# EasyEDA Pro project SATAHDDProtectors.eprj

# Schematic 过滤与保护
Board Name: Board1; Create Date: 2025-07-08; Page Name: P1; Project Name: SATAHDDProtectors; Schematic Name: 过滤与保护; Update Date: 2025-07-10; Company: 嘉立创EDA; Page Size: A4; Version: V1.0
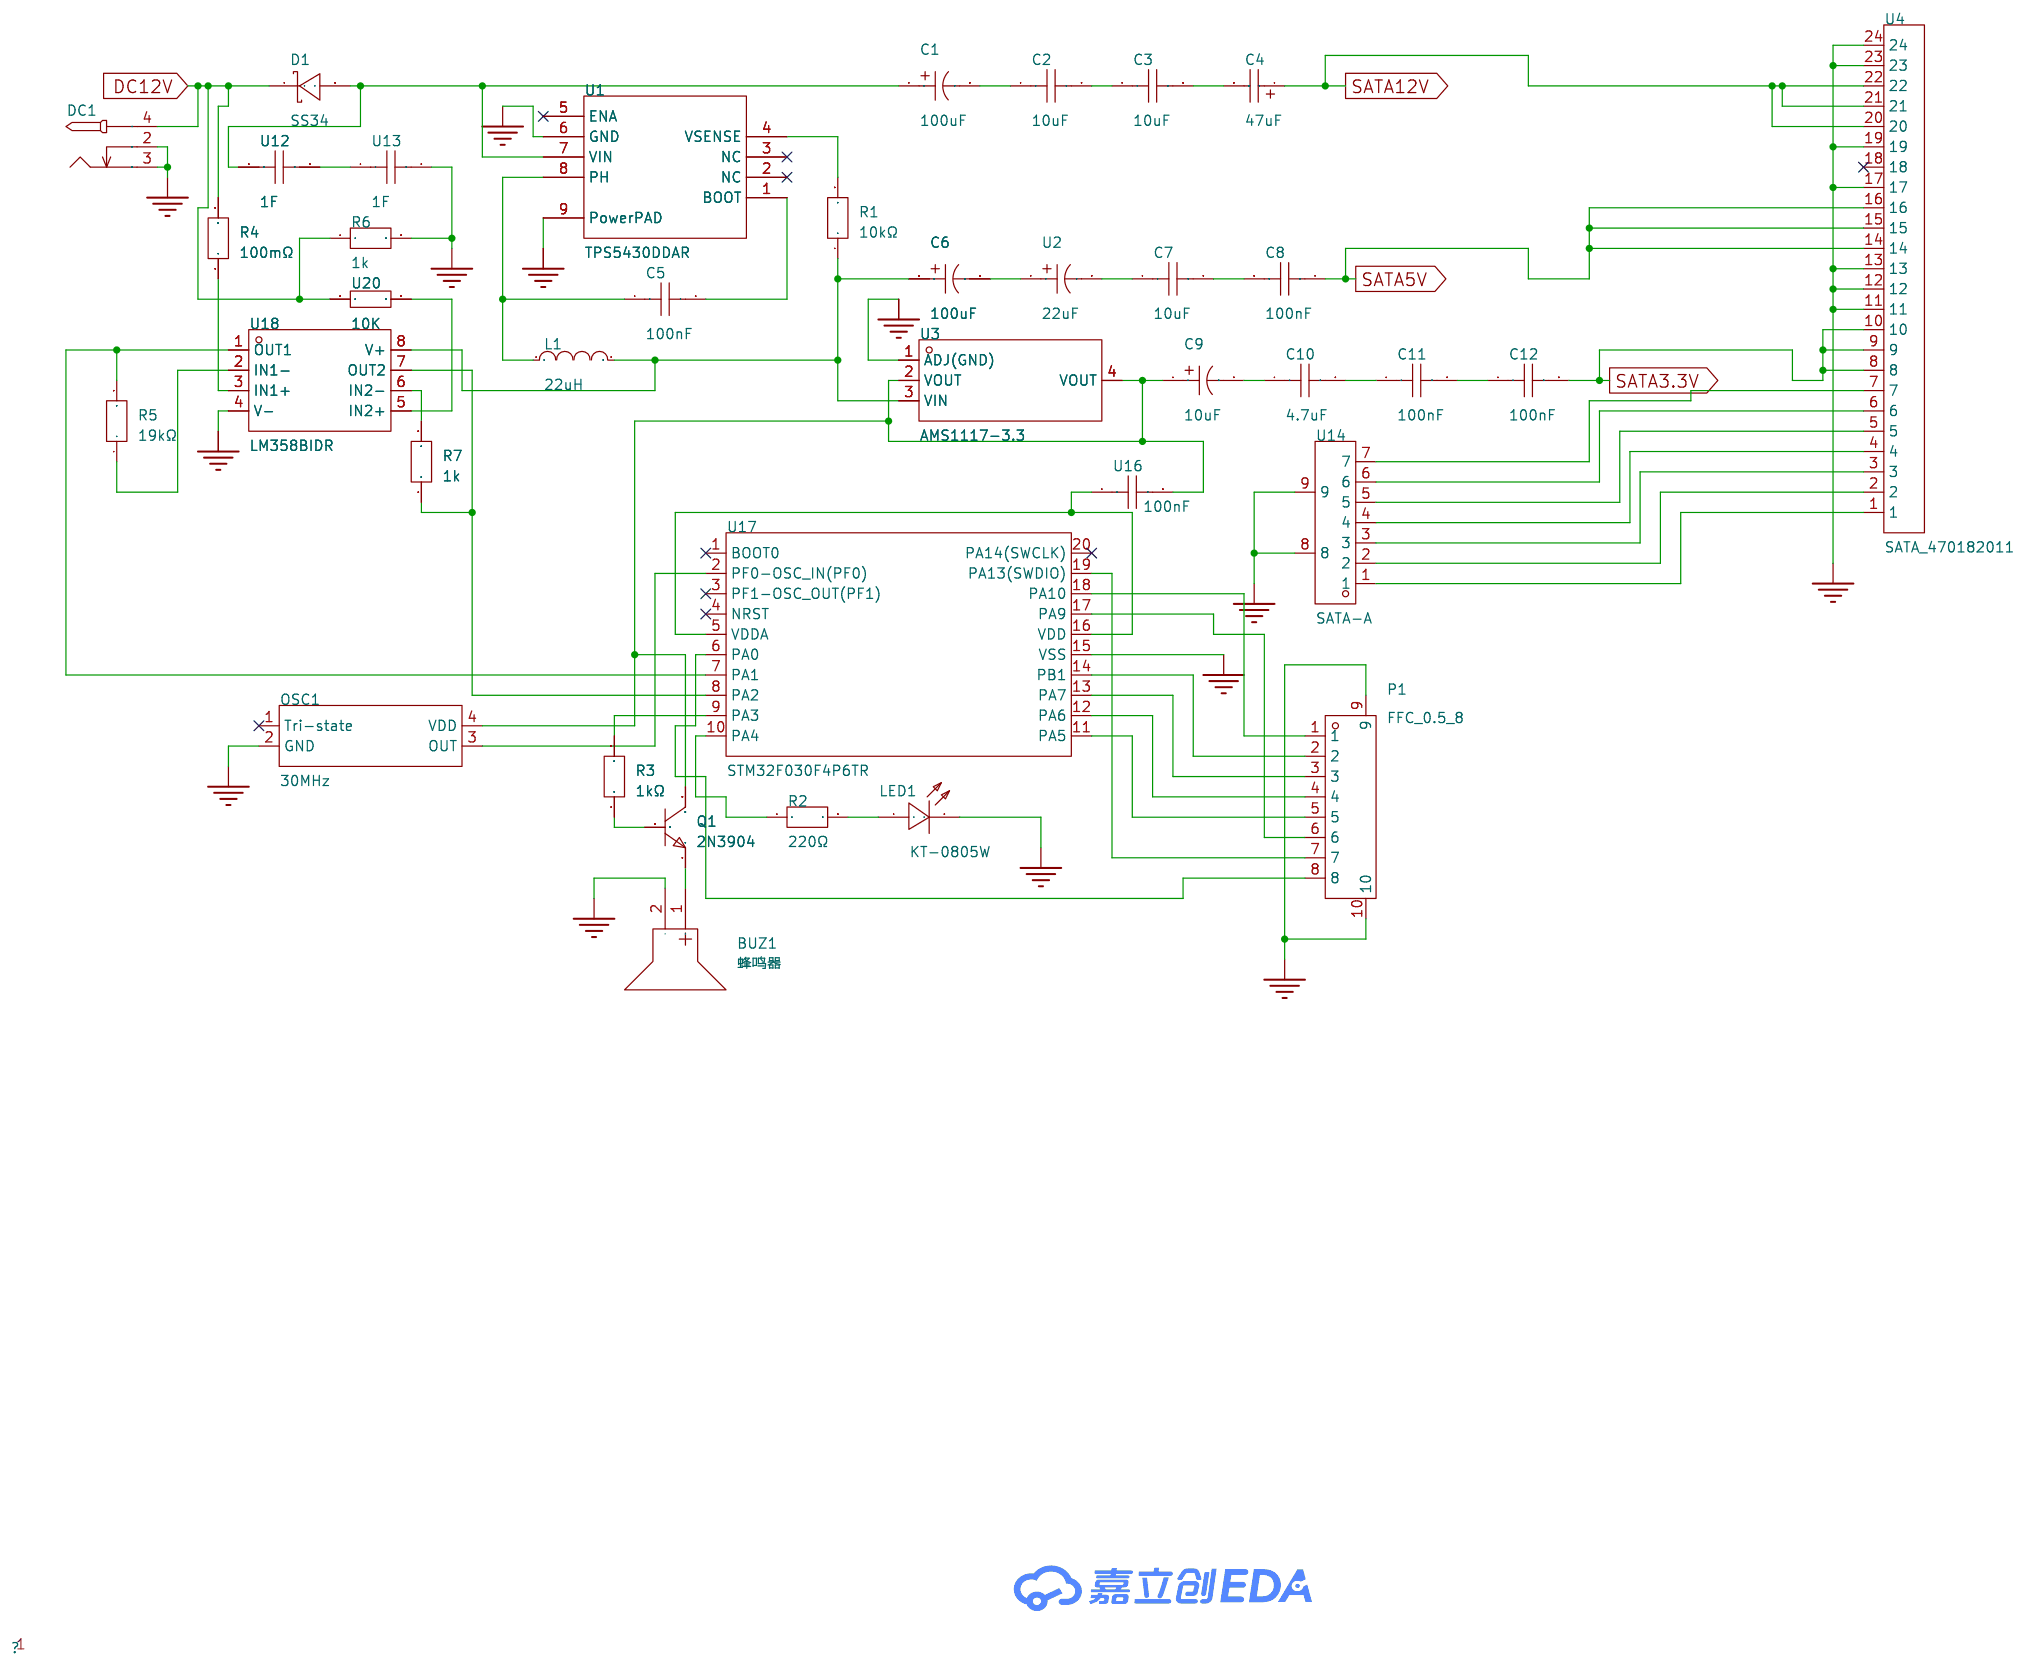
[diagram p0: schematic sheet]

## Parts
BUZ1  蜂鸣器  [BUZ-TH_BD9.0-P5.00-D0.6-FD]
C1  100uF  [CAP-SMD_BD6.3-L6.6-W6.6-LS7.6-FD-1]
C2  10uF  [C1206]
C3  10uF  [C1206]
C4  47uF  [CAP-SMD_L6.0-W3.2-R-RD]
C5  100nF  [C0402]
C6  100uF  [CAP-SMD_BD5.0-L5.3-W5.3-LS6.0-FD]
C7  10uF  [C0805]
C8  100nF  [C0402]
C9  10uF  [CAP-SMD_L2.0-W1.3-FD]
C10  4.7uF  [C0603]
C11  100nF  [C0201]
C12  100nF  [C0201]
D1  SS34  [SMA_L4.3-W2.6-LS5.0-RD]
DC1  -  [DC-2.0]
L1  22uH  [IND-SMD_L3.0-W3.0_FNR30XXS]
LED1  KT-0805W  [LED0805-R-RD]
OSC1  30MHz  [OSC-SMD_4P-L3.2-W2.5-BL]
P1  FFC_0.5_8  [CONN-SMD_8P-P0.50_FGXJ]
Q1  2N3904  [TO-92-3_L4.9-W3.7-P1.27-L]
R1  10kΩ  [R0603]
R2  220Ω  [R0603]
R3  1kΩ  [R0402]
R4  100mΩ  [R0805]
R5  19kΩ  [R0805]
R6  1k  [R0603]
R7  1k  [R0603]
U1  TPS5430DDAR  [ESOP-8_L4.9-W3.9-P1.27-LS6.0-TL-EP]
U2  22uF  [CAP-SMD_BD4.0-L4.3-W4.3-LS5.0-FD]
U3  AMS1117-3.3  [SOT-223-3_L6.5-W3.4-P2.30-LS7.0-BR]
U4  SATA_470182011  [CONN-SMD_22P-SATA_470182011]
U12  1F  [CAP-TH_L16.0-W8.0-P11.50-D0.6]
U13  1F  [CAP-TH_L16.0-W8.0-P11.50-D0.6]
U14  SATA-A  [CONN-SMD_SATA-A]
U16  100nF  [CAP-TH_L7.2-W2.5-P5.00-D1.0]
U17  STM32F030F4P6TR  [SOP-20_L6.5-W4.4-P0.65-LS6.4-BL]
U18  LM358BIDR  [SOIC-8_L4.9-W3.9-P1.27-LS6.0-BL]
U20  10K  [R0805]

## Library data of the parts
BUZ1 = 蜂鸣器: Supplier Part: C9900020875; Supplier Footprint: 插件; JLCPCB Part Class: 扩展库; Supplier: LCSC
C1 = RVE100UF35V67RV0072: LCSC Part Name: 100uF ±20% 35V; Supplier Part: C2836437; Manufacturer: KNSCHA(科尼盛); Supplier Footprint: SMD,D6.3xL7.7mm; JLCPCB Part Class: 扩展库; Datasheet: https://atta.szlcsc.com/upload/public/pdf/source/20220719/B52EB46F8A1558448ED03D8B4CB3C24F.pdf; Supplier: LCSC; Tolerance: ±20%; Rated Voltage: 35V; Ripple Current: 230mA@120Hz; Equivalent Series Resistance(ESR): 600mΩ@100kHz; φD: 6.3mm; L: 7.7mm; Lifetime @ Temp: 2000hrs@105℃; Operating Temperature: -55℃~+105℃
C2 C3 = CL31B106KAHNNNE: LCSC Part Name: 10uF ±10% 25V; Supplier Part: C14860; Manufacturer: SAMSUNG(三星); Supplier Footprint: 1206; JLCPCB Part Class: 扩展库; Datasheet: https://atta.szlcsc.com/upload/public/pdf/source/20160218/1457707763339.pdf; Supplier: LCSC; Tolerance: ±10%; Voltage Rated: 25V; Temperature Coefficient: X7R
C4 = TAJC476K016RNJ: LCSC Part Name: 47uF ±10% 16V; Supplier Part: C7219; Manufacturer: Kyocera AVX; Supplier Footprint: CASE-C-6032; JLCPCB Part Class: 扩展库; Datasheet: https://atta.szlcsc.com/upload/public/pdf/source/20160107/1457707750344.pdf; Supplier: LCSC; Tolerance: ±10%; Rated Voltage: 16V; Equivalent Series Resistance(ESR): 500mΩ@100kHz; Operating Temperature: -55℃~+125℃
C5 = CL05B104KB54PNC: LCSC Part Name: 100nF ±10% 50V; Supplier Part: C307331; Manufacturer: SAMSUNG(三星); Supplier Footprint: 0402; JLCPCB Part Class: 基础库; Datasheet: https://atta.szlcsc.com/upload/public/pdf/source/20160218/1457707763339.pdf; Supplier: LCSC; Tolerance: ±10%; Voltage Rated: 50V; Temperature Coefficient: X7R
C6 = RVT100UF10V67RV0036: LCSC Part Name: 100uF ±20% 10V; Supplier Part: C2891567; Manufacturer: KNSCHA(科尼盛); Supplier Footprint: SMD,D5xL5.4mm; JLCPCB Part Class: 扩展库; Datasheet: https://atta.szlcsc.com/upload/public/pdf/source/20210827/8FAD24A066DC13F669552387C8DDE55C.pdf; Supplier: LCSC; Tolerance: ±20%; Rated Voltage: 10V; Ripple Current: 40mA@120Hz; φD: 5mm; L: 5.4mm; Lifetime @ Temp: 2000hrs@105℃; Operating Temperature: -55℃~+105℃
C7 = LMK212BB7106KGHT: LCSC Part Name: 10uF ±10% 10V 陶瓷电容器 [通信基础设施·产业机器用途 多层陶瓷电容器 (高介电常数型)]; Supplier Part: C3040931; Manufacturer: TAIYO YUDEN(太诱); Supplier Footprint: 0805; JLCPCB Part Class: 扩展库; Datasheet: https://atta.szlcsc.com/upload/public/pdf/source/20240118/06E5B70A06AE66EA5B3A0FB4DAE75DCD.pdf; Supplier: LCSC; Tolerance: ±10%; Voltage Rating: 10V; Temperature Coefficient: X7R
C8 = CC0402KRX7R6BB104: LCSC Part Name: 100nF ±10% 10V; Supplier Part: C309458; Manufacturer: YAGEO(国巨); Supplier Footprint: 0402; JLCPCB Part Class: 扩展库; Datasheet: https://atta.szlcsc.com/upload/public/pdf/source/20181008/C309510_22F155564471FAF6A489F7D68F34234E.pdf; Supplier: LCSC; Tolerance: ±10%; Voltage Rated: 10V; Temperature Coefficient: X7R
C9 = CA45-P-6.3V-10UF-K: LCSC Part Name: 10uF ±10% 6.3V; Supplier Part: C2844395; Manufacturer: CEC(振华新云); Supplier Footprint: CASE-P-2012-12(mm); JLCPCB Part Class: 扩展库; Datasheet: https://atta.szlcsc.com/upload/public/pdf/source/20210702/C2844395_E7EBF1B65FEA8FC3CE954A9FCB08EE3D.pdf; Supplier: LCSC; Tolerance: ±10%; Voltage Rating: 6.3V
C10 = CL10B475KQ8NQNC: LCSC Part Name: 4.7uF ±10% 6.3V; Supplier Part: C107368; Manufacturer: SAMSUNG(三星); Supplier Footprint: 0603; JLCPCB Part Class: 扩展库; Datasheet: https://atta.szlcsc.com/upload/public/pdf/source/20160218/1457707763339.pdf; Supplier: LCSC; Tolerance: ±10%; Voltage Rated: 6.3V; Temperature Coefficient: X7R
C11 C12 = CC0201KRX7R5BB104: LCSC Part Name: 100nF ±10% 6.3V; Supplier Part: C1882920; Manufacturer: YAGEO(国巨); Supplier Footprint: 0201; JLCPCB Part Class: 扩展库; Datasheet: https://atta.szlcsc.com/upload/public/pdf/source/20210526/C1882920_D9D8C0826F711D89E4322037F9B616A1.pdf; Supplier: LCSC; Tolerance: ±10%; Voltage Rated: 6.3V; Temperature Coefficient: X7R
D1 = SS34: Supplier Part: C9900023345; Supplier Footprint: SMA,DO-214AC; JLCPCB Part Class: 扩展库; Supplier: LCSC
DC1 = DC-005_2.0: Supplier Footprint: 插件
L1 = FNR3015S220MT: LCSC Part Name: 22uH ±20% 680mA; Supplier Part: C167761; Manufacturer: cjiang(长江微电); Supplier Footprint: SMD,3x3mm; JLCPCB Part Class: 扩展库; Datasheet: https://atta.szlcsc.com/upload/public/pdf/source/20190327/C167925_9EFF0AABC4CA629C2CC95961DBF7D39D.pdf; Supplier: LCSC; Tolerance: ±20%; Rated Current: 690mA; Saturation Current (Isat): 680mA; DC Resistance (DCR): 598mΩ
LED1 = KT-0805W: LCSC Part Name: 0805 白灯 高亮; Supplier Part: C34499; Manufacturer: KENTO; Supplier Footprint: 0805; JLCPCB Part Class: 基础库; Datasheet: https://atta.szlcsc.com/upload/public/pdf/source/20221124/DAA20402FFC1FB071B8B6797757426FE.pdf; Supplier: LCSC
OSC1 = OT2EL89CJI-111YLC-30M: LCSC Part Name: YSO110TR 30MHZ 4P 3225 1.8V-3.3V ±10PPM -40~85℃（±20PPM) CMOS; Supplier Part: C7434928; Manufacturer: YXC(扬兴晶振); Supplier Footprint: SMD3225-4P; JLCPCB Part Class: 扩展库; Datasheet: https://atta.szlcsc.com/upload/public/pdf/source/20240731/596E5F7673E50DA744B7F79F139FB8DF.pdf; Supplier: LCSC; Normal temperature Frequency Tolerance: ±10ppm; Output Type: CMOS; Voltage - Supply: 1.8V~3.3V; Frequency Stability: ±20ppm; Operating Temperature: -40℃~+85℃
P1 = FFC_0.5_8: Supplier Part: C9900003973; JLCPCB Part Class: 扩展库; Supplier: LCSC
Q1 = 2N3904: Supplier Part: C713605; Manufacturer: LGE(鲁光); Supplier Footprint: TO-92-3; JLCPCB Part Class: 扩展库; Datasheet: https://atta.szlcsc.com/upload/public/pdf/source/20200731/C713605_8569D7FBD9E5046E21F23BBCCB772DFC.pdf; Supplier: LCSC; type: NPN; Current - Collector(Ic): 200mA; Collector - Emitter Voltage VCEO: 40V; Pd - Power Dissipation: 625mW; DC Current Gain: 60@50mA,1V; Transition frequency(fT): 300MHz; Current - Collector Cutoff: 100nA; Vce Saturation(VCE(sat)): 300mV; Operating Temperature: -55℃~+150℃
R1 = FRC0603J103 TS: LCSC Part Name: 10kΩ ±5% 100mW 厚膜电阻; Supplier Part: C2930027; Manufacturer: FOJAN(富捷); Supplier Footprint: 0603; JLCPCB Part Class: 扩展库; Datasheet: https://atta.szlcsc.com/upload/public/pdf/source/20211221/925EC7D7225764EE0046F22065062C87.pdf; Supplier: LCSC; Type: 厚膜电阻; Tolerance: ±5%; Power(Watts): 100mW; Voltage-Supply(Max): 75V; Temperature Coefficient: ±100ppm/℃; Operating Temperature: -55℃~+155℃
R2 = FRC0603J221 TS: LCSC Part Name: 220Ω ±5% 100mW 厚膜电阻; Supplier Part: C2907127; Manufacturer: FOJAN(富捷); Supplier Footprint: 0603; JLCPCB Part Class: 扩展库; Datasheet: https://atta.szlcsc.com/upload/public/pdf/source/20211221/925EC7D7225764EE0046F22065062C87.pdf; Supplier: LCSC; Type: 厚膜电阻; Tolerance: ±5%; Power(Watts): 100mW; Overload Voltage (Max): 75V; Temperature Coefficient: ±100ppm/℃; Operating Temperature Range: -55℃~+155℃
R3 = RT0402BRD071KL: LCSC Part Name: 薄膜电阻 1kΩ ±0.1% 62.5mW; Supplier Part: C852624; Manufacturer: YAGEO(国巨); Supplier Footprint: 0402; JLCPCB Part Class: 扩展库; Datasheet: https://atta.szlcsc.com/upload/public/pdf/source/20210609/C852624_9EB141A274604F87C6BB037C8019D50A.pdf; Supplier: LCSC; Type: 薄膜电阻; Tolerance: ±0.1%; Power(Watts): 62.5mW; Overload Voltage (Max): 50V; Temperature Coefficient: ±25ppm/℃; Operating Temperature Range: -55℃~+155℃
R4 = FBF05FTPR100-00L: LCSC Part Name: 停产 100mΩ ±1% 250mW; Supplier Part: C382279; Manufacturer: PSA(信昌电陶); Supplier Footprint: 0805; JLCPCB Part Class: 扩展库; Datasheet: https://atta.szlcsc.com/upload/public/pdf/source/20190605/C395975_CD3922AEFB9A6855CDCC23BA20804B28.pdf; Supplier: LCSC; Tolerance: ±1%; Power(Watts): 250mW; Temperature Coefficient: ±100ppm/℃
R5 = FRC0805F1902TS: LCSC Part Name: 19kΩ ±1% 125mW 厚膜电阻; Supplier Part: C2930177; Manufacturer: FOJAN(富捷); Supplier Footprint: 0805; JLCPCB Part Class: 扩展库; Datasheet: https://atta.szlcsc.com/upload/public/pdf/source/20211221/925EC7D7225764EE0046F22065062C87.pdf; Supplier: LCSC; Type: 厚膜电阻; Tolerance: ±1%; Power(Watts): 125mW; Overload Voltage (Max): 150V; Temperature Coefficient: ±100ppm/℃; Operating Temperature Range: -55℃~+155℃
R6 R7 = 1k: Supplier Part: C9900012840; JLCPCB Part Class: 扩展库; Supplier: LCSC
U1 = TPS5430DDAR: LCSC Part Name: 宽输入范围、3A输出电流的降压转换器; Supplier Part: C9864; Manufacturer: TI(德州仪器); Supplier Footprint: SOIC-8-EP; JLCPCB Part Class: 基础库; Datasheet: https://www.ti.com/cn/lit/gpn/tps5430; Supplier: LCSC; Function: 降压型; Output Type: 可调; Input Voltage: 5.5V~36V; Output Voltage: 1.221V~32.04V; Output Current: 3A; Switching Frequency: 500kHz; Operating Temperature: -40℃~+125℃@(TJ); Synchronous Rectification: 否; Number of Outputs: 1; Topology: 降压式; Switch tube (built-in/external): 内置
U2 = RVT1A220M0405 22UF 10V: LCSC Part Name: 22uF ±20% 10V; Supplier Part: C970661; Manufacturer: DMBJ(振宝佳); Supplier Footprint: SMD,D4xL5.4mm; JLCPCB Part Class: 扩展库; Datasheet: https://atta.szlcsc.com/upload/public/pdf/source/20201217/C970594_282EC4D70669AEE33806F6C24A5FAA0B.pdf; Supplier: LCSC; Tolerance: ±20%; Voltage Rating: 10V; Ripple Current: 21mA@120Hz; Diameter: 4mm; Height - Seated (Max): 5.4mm; Lifetime: 2800hrs@105℃; Operating Temperature: -55℃~+105℃
U3 = AMS1117-3.3: LCSC Part Name: 输入18V 输出3.3V 1A; Supplier Part: C2891839; Manufacturer: YONGYUTAI(永裕泰); Supplier Footprint: SOT-223-3; JLCPCB Part Class: 扩展库; Datasheet: https://atta.szlcsc.com/upload/public/pdf/source/20210901/A75ADDE6A17DEE0002F2A58A8D1F3634.pdf; Supplier: LCSC; Output Type: 固定; Maximum Input Voltage: 18V; Output Voltage: 3.3V; MAX Output Current: 1A; Power Supply Rejection Ratio (PSRR): 60dB@(120Hz); Dropout Voltage: 1.3V@(1A); standby current: 5mA; Noise: 0.005%Vout; Operating Temperature: -40℃~+125℃@(Tj); Output Polarity: 正极; Number of Outputs: 1
U4 = SATA_470182011: Supplier Part: C2936562; JLCPCB Part Class: 扩展库; Supplier: LCSC
U12 U13 = CHP5R5L105R-TWQ 5.5V1F: LCSC Part Name: 1F 0%~+100% 5.5V; Supplier Part: C2925921; Manufacturer: CDA(智烽维); Supplier Footprint: 插件,P=11.5mm; JLCPCB Part Class: 扩展库; Datasheet: https://atta.szlcsc.com/upload/public/pdf/source/20211220/77423F7204DF2A1DF41A483AD9B86B67.pdf; Supplier: LCSC; Tolerance: 0%~+100%; Voltage Rating: 5.5V; Current - Leakage: 12uA@72hrs; Equivalent Series Resistance(ESR): 200mΩ@1kHz; Lifetime: 2000hrs@70℃; Operating Temperature: -40℃~+70℃; Diameter: 8mm; Height - Seated(Max): 22mm
U14 = SATA-A: Supplier Part: C9900004587; Supplier Footprint: sata-7p; JLCPCB Part Class: 扩展库; Supplier: LCSC
U16 = MEB104J63V82CB0236: LCSC Part Name: 100nF ±5% 63V; Supplier Part: C3034535; Manufacturer: KNSCHA(科尼盛); Supplier Footprint: 插件,P=5mm; JLCPCB Part Class: 扩展库; Datasheet: https://atta.szlcsc.com/upload/public/pdf/source/20220613/95E40529FEB7A3E68EC83AD5A7304622.pdf; Supplier: LCSC; Tolerance: ±5%; Voltage Rated: 63V; Dielectric Material: 金属化聚酯; Operating Temperature: -40℃~+110℃
U17 = STM32F030F4P6TR: LCSC Part Name: 主流ARM Cortex-M0超值系列MCU，具有16 KB Flash和48 MHz CPU; Supplier Part: C89040; Manufacturer: ST(意法半导体); Supplier Footprint: TSSOP-20; JLCPCB Part Class: 扩展库; Datasheet: https://atta.szlcsc.com/upload/public/pdf/source/20180905/C276001_32B49CC93E98DA820BBF971FAA3B8C42.pdf; Supplier: LCSC; CPU Core: ARM-M0; CPU Maximum Speed: 48MHz; Program Storage Size: 16KB; Program Memory Type: FLASH; Number of I/O: 15; ADC (Bit): 12bit; Voltage - Supply: 2.4V~3.6V
U18 = LM358BIDR: LCSC Part Name: 行业标准双路运算放大器; Supplier Part: C1850238; Manufacturer: TI(德州仪器); Supplier Footprint: SOIC-8; JLCPCB Part Class: 扩展库; Datasheet: https://www.ti.com/cn/lit/gpn/lm358ba; Supplier: LCSC; Number of Circuits: 双路; Gain Bandwidth Product(GBP): 1.2MHz; Current - Input Bias(Ib): 10nA; Slew Rate(SR): 0.5V/us; Output Current: 40mA; Operating Temperature: -40℃~+85℃
U20 = 10K: Supplier Part: C9900011271; JLCPCB Part Class: 扩展库; Supplier: LCSC

## Nets
GND: BUZ1.2(-) DC1.2 DC1.3 LED1.2(K) OSC1.2(GND) P1.9 P1.10 R6.2 U1.6(GND) U1.9(PowerPAD) U3.1(ADJ(GND)) U4.11 U4.12 U4.13 U4.17 U4.19 U4.23 U4.24 U13.2 U14.8 U14.9 U17.15(VSS) U18.4(V-)
DC12V: D1.1(K) DC1.4 R4.2 R6.1 U20.1
SATA3.3V: C12.2 U4.8 U4.9 U4.10
SATA5V: C8.1 U4.14 U4.15 U4.16
SATA12V: C4.1 U4.20 U4.21 U4.22
Net-(BUZ1-1): BUZ1.1(+) Q1.1(E)
Net-(C1-1): C1.1 D1.2(A) U1.7(VIN) U12.1
Net-(C1-2): C1.2 C2.1
Net-(C2-2): C2.2 C3.1
Net-(C3-2): C3.2 C4.2
Net-(C5-1): C5.1 L1.1 U1.8(PH)
Net-(C5-2): C5.2 U1.1(BOOT)
Net-(C6-1): C6.1 L1.2 R1.1 U3.3(VIN) U18.8(V+)
Net-(C6-2): C6.2 U2.1
Net-(C7-1): C7.1 U2.2
Net-(C7-2): C7.2 C8.2
Net-(C9-1): C9.1 OSC1.4(VDD) Q1.3(C) U3.2(VOUT) U3.4(VOUT) U16.2
Net-(C9-2): C9.2 C10.1
Net-(C10-2): C10.2 C11.1
Net-(C11-2): C11.2 C12.1
Net-(LED1-1): LED1.1(A) R2.2
Net-(OSC1-3): OSC1.3(OUT) U17.2(PF0-OSC_IN(PF0))
Net-(P1-1): P1.1 U17.18(PA10)
Net-(P1-2): P1.2 U17.14(PB1)
Net-(P1-3): P1.3 U17.13(PA7)
Net-(P1-4): P1.4 U17.12(PA6)
Net-(P1-5): P1.5 U17.11(PA5)
Net-(P1-6): P1.6 U17.17(PA9)
Net-(P1-7): P1.7 U17.19(PA13(SWDIO))
Net-(P1-8): P1.8 U17.6(PA0)
Net-(Q1-2): Q1.2(B) R3.1
Net-(R1-2): R1.2 U1.4(VSENSE)
Net-(R2-1): R2.1 U17.10(PA4)
Net-(R3-2): R3.2 U17.9(PA3)
Net-(R4-1): R4.1 U18.3(IN1+)
Net-(R5-1): R5.1 U18.2(IN1-)
Net-(R5-2): R5.2 U17.7(PA1) U18.1(OUT1)
Net-(R7-1): R7.1 U17.8(PA2) U18.7(OUT2)
Net-(R7-2): R7.2 U18.6(IN2-)
Net-(U4-1): U4.1 U14.1
Net-(U4-2): U4.2 U14.2
Net-(U4-3): U4.3 U14.3
Net-(U4-4): U4.4 U14.4
Net-(U4-5): U4.5 U14.5
Net-(U4-6): U4.6 U14.6
Net-(U4-7): U4.7 U14.7
Net-(U12-2): U12.2 U13.1
Net-(U16-1): U16.1 U17.5(VDDA) U17.16(VDD)
Net-(U18-5): U18.5(IN2+) U20.2

Not connected (* = marked no-connect by the designer): OSC1 1(Tri-state)*; U1 2(NC)* 3(NC)* 5(ENA)*; U4 18*; U17 1(BOOT0)* 3(PF1-OSC_OUT(PF1))* 4(NRST)* 20(PA14(SWCLK))*

# Schematic 无单片机版
Board Name: 无单片机版; Create Date: 2025-07-13; Page Name: P1; Project Name: SATAHDDProtectors; Schematic Name: 无单片机版; Update Date: 2025-07-14; Company: 嘉立创EDA; Page Size: A4; Version: V1.0
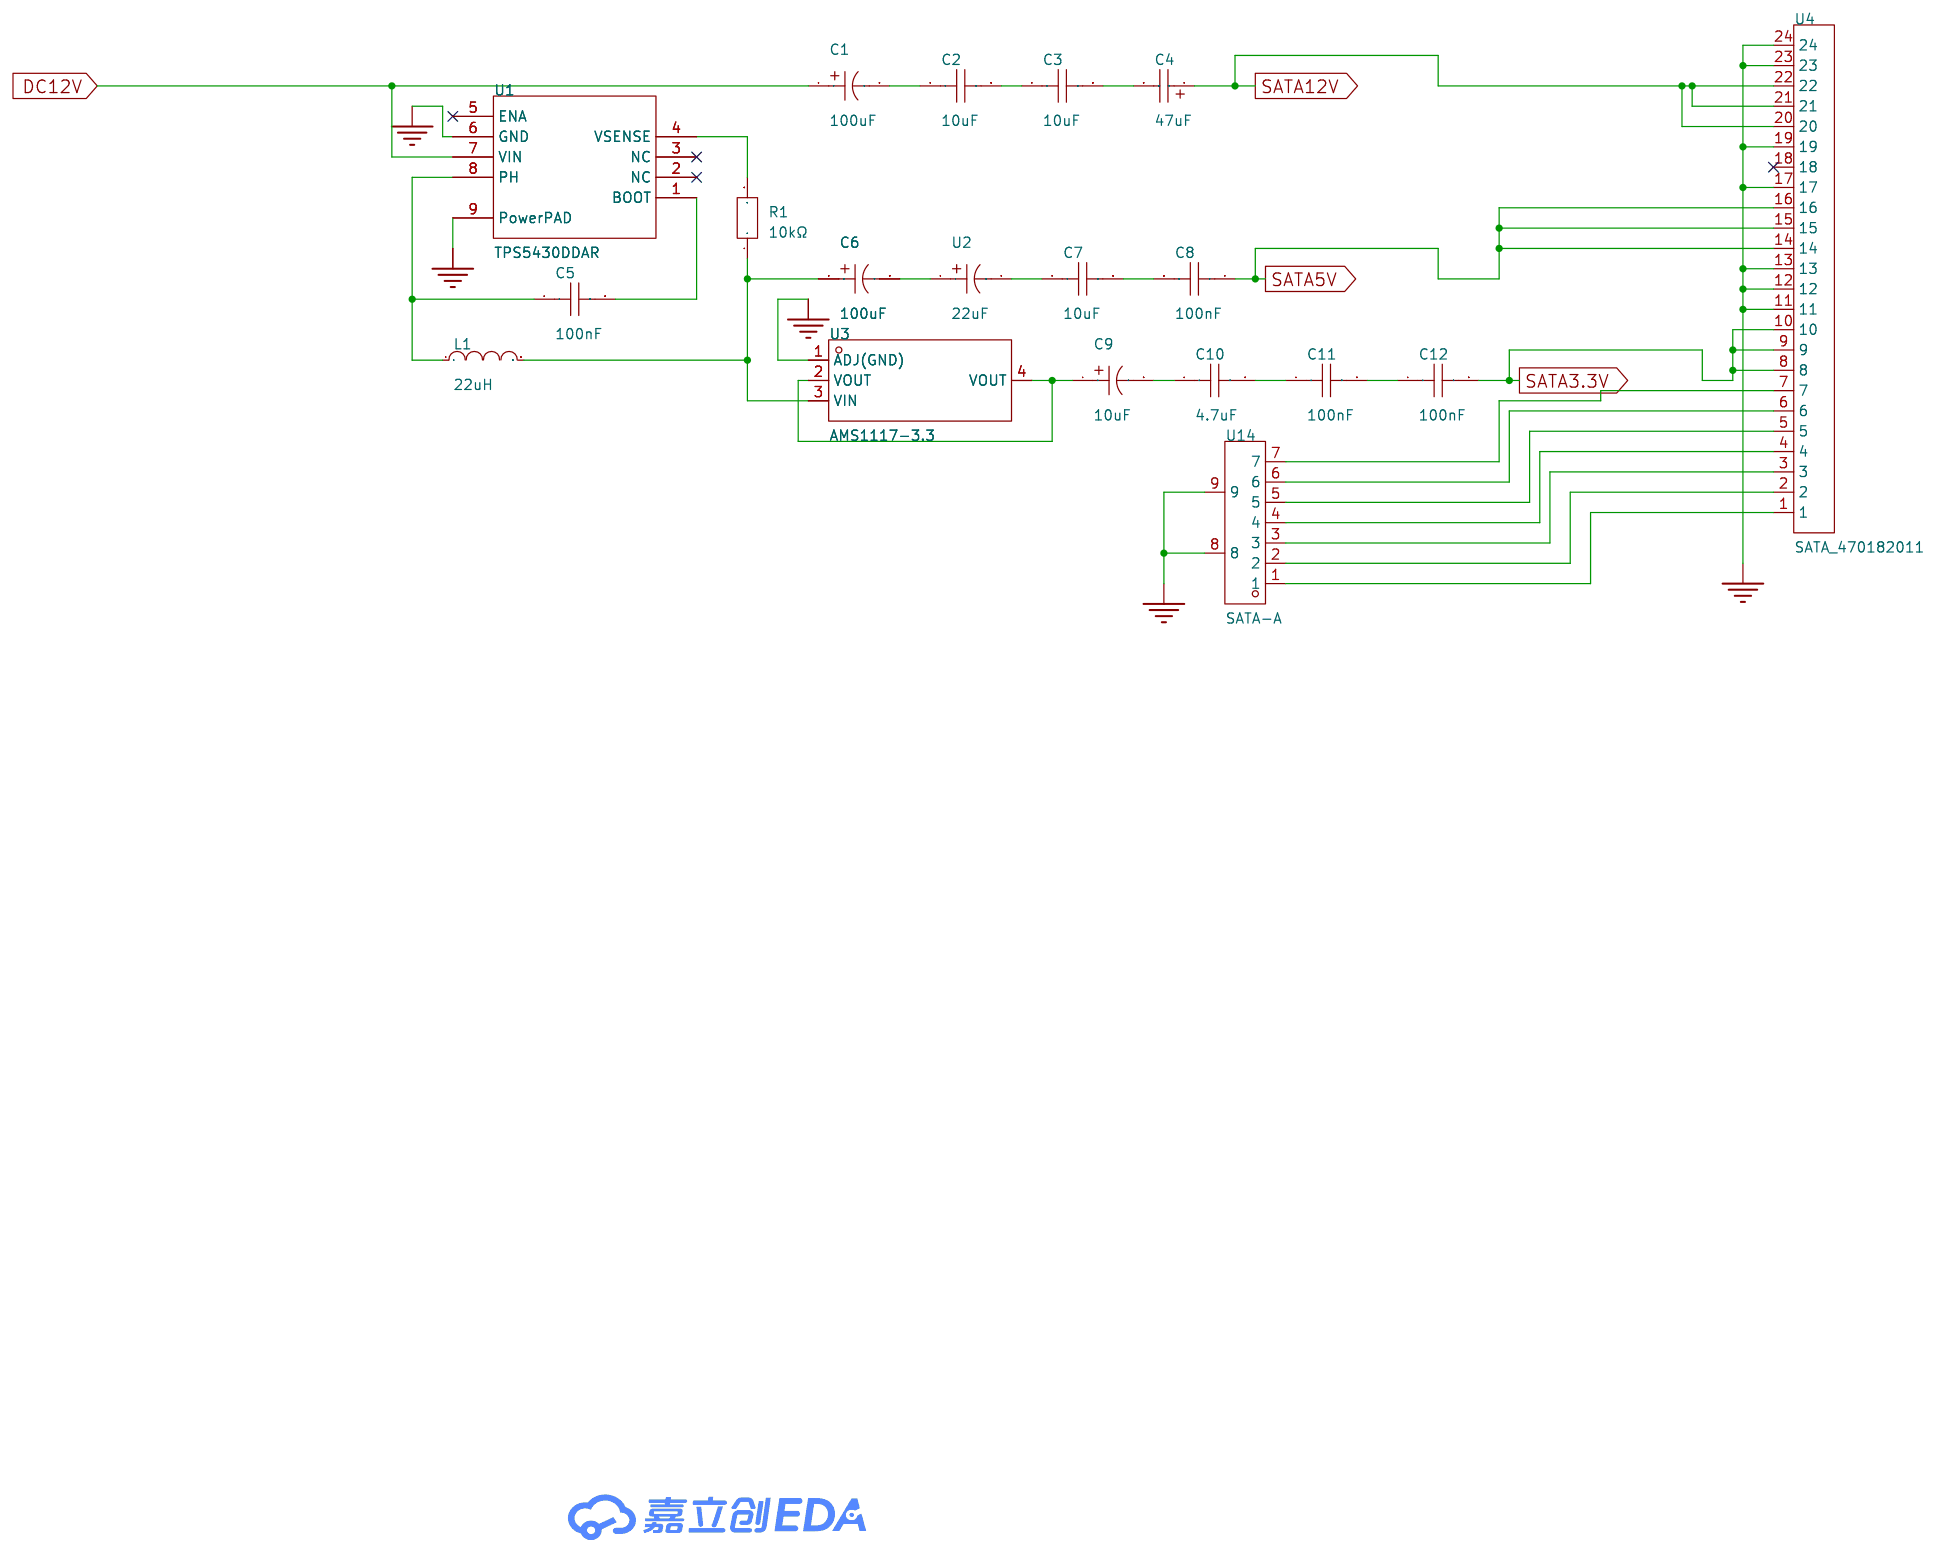
[diagram p1: schematic sheet]

## Parts
C1  100uF  [CAP-SMD_BD6.3-L6.6-W6.6-LS7.6-FD-1]
C2  10uF  [C1206]
C3  10uF  [C1206]
C4  47uF  [CAP-SMD_L6.0-W3.2-R-RD]
C5  100nF  [C0402]
C6  100uF  [CAP-SMD_BD5.0-L5.3-W5.3-LS6.0-FD]
C7  10uF  [C0805]
C8  100nF  [C0402]
C9  10uF  [CAP-SMD_L2.0-W1.3-FD]
C10  4.7uF  [C0603]
C11  100nF  [C0201]
C12  100nF  [C0201]
L1  22uH  [IND-SMD_L3.0-W3.0_FNR30XXS]
R1  10kΩ  [R0603]
U1  TPS5430DDAR  [ESOP-8_L4.9-W3.9-P1.27-LS6.0-TL-EP]
U2  22uF  [CAP-SMD_BD4.0-L4.3-W4.3-LS5.0-FD]
U3  AMS1117-3.3  [SOT-223-3_L6.5-W3.4-P2.30-LS7.0-BR]
U4  SATA_470182011  [CONN-SMD_22P-SATA_470182011]
U14  SATA-A  [CONN-SMD_SATA-A]

## Library data of the parts
C1 = RVE100UF35V67RV0072: LCSC Part Name: 100uF ±20% 35V; Supplier Part: C2836437; Manufacturer: KNSCHA(科尼盛); Supplier Footprint: SMD,D6.3xL7.7mm; JLCPCB Part Class: 扩展库; Datasheet: https://atta.szlcsc.com/upload/public/pdf/source/20220719/B52EB46F8A1558448ED03D8B4CB3C24F.pdf; Supplier: LCSC; Tolerance: ±20%; Rated Voltage: 35V; Ripple Current: 230mA@120Hz; Equivalent Series Resistance(ESR): 600mΩ@100kHz; φD: 6.3mm; L: 7.7mm; Lifetime @ Temp: 2000hrs@105℃; Operating Temperature: -55℃~+105℃
C2 C3 = CL31B106KAHNNNE: LCSC Part Name: 10uF ±10% 25V; Supplier Part: C14860; Manufacturer: SAMSUNG(三星); Supplier Footprint: 1206; JLCPCB Part Class: 扩展库; Datasheet: https://atta.szlcsc.com/upload/public/pdf/source/20160218/1457707763339.pdf; Supplier: LCSC; Tolerance: ±10%; Voltage Rated: 25V; Temperature Coefficient: X7R
C4 = TAJC476K016RNJ: LCSC Part Name: 47uF ±10% 16V; Supplier Part: C7219; Manufacturer: Kyocera AVX; Supplier Footprint: CASE-C-6032; JLCPCB Part Class: 扩展库; Datasheet: https://atta.szlcsc.com/upload/public/pdf/source/20160107/1457707750344.pdf; Supplier: LCSC; Tolerance: ±10%; Rated Voltage: 16V; Equivalent Series Resistance(ESR): 500mΩ@100kHz; Operating Temperature: -55℃~+125℃
C5 = CL05B104KB54PNC: LCSC Part Name: 100nF ±10% 50V; Supplier Part: C307331; Manufacturer: SAMSUNG(三星); Supplier Footprint: 0402; JLCPCB Part Class: 基础库; Datasheet: https://atta.szlcsc.com/upload/public/pdf/source/20160218/1457707763339.pdf; Supplier: LCSC; Tolerance: ±10%; Voltage Rated: 50V; Temperature Coefficient: X7R
C6 = RVT100UF10V67RV0036: LCSC Part Name: 100uF ±20% 10V; Supplier Part: C2891567; Manufacturer: KNSCHA(科尼盛); Supplier Footprint: SMD,D5xL5.4mm; JLCPCB Part Class: 扩展库; Datasheet: https://atta.szlcsc.com/upload/public/pdf/source/20210827/8FAD24A066DC13F669552387C8DDE55C.pdf; Supplier: LCSC; Tolerance: ±20%; Rated Voltage: 10V; Ripple Current: 40mA@120Hz; φD: 5mm; L: 5.4mm; Lifetime @ Temp: 2000hrs@105℃; Operating Temperature: -55℃~+105℃
C7 = LMK212BB7106KGHT: LCSC Part Name: 10uF ±10% 10V 陶瓷电容器 [通信基础设施·产业机器用途 多层陶瓷电容器 (高介电常数型)]; Supplier Part: C3040931; Manufacturer: TAIYO YUDEN(太诱); Supplier Footprint: 0805; JLCPCB Part Class: 扩展库; Datasheet: https://atta.szlcsc.com/upload/public/pdf/source/20240118/06E5B70A06AE66EA5B3A0FB4DAE75DCD.pdf; Supplier: LCSC; Tolerance: ±10%; Voltage Rating: 10V; Temperature Coefficient: X7R
C8 = CC0402KRX7R6BB104: LCSC Part Name: 100nF ±10% 10V; Supplier Part: C309458; Manufacturer: YAGEO(国巨); Supplier Footprint: 0402; JLCPCB Part Class: 扩展库; Datasheet: https://atta.szlcsc.com/upload/public/pdf/source/20181008/C309510_22F155564471FAF6A489F7D68F34234E.pdf; Supplier: LCSC; Tolerance: ±10%; Voltage Rated: 10V; Temperature Coefficient: X7R
C9 = CA45-P-6.3V-10UF-K: LCSC Part Name: 10uF ±10% 6.3V; Supplier Part: C2844395; Manufacturer: CEC(振华新云); Supplier Footprint: CASE-P-2012-12(mm); JLCPCB Part Class: 扩展库; Datasheet: https://atta.szlcsc.com/upload/public/pdf/source/20210702/C2844395_E7EBF1B65FEA8FC3CE954A9FCB08EE3D.pdf; Supplier: LCSC; Tolerance: ±10%; Voltage Rating: 6.3V
C10 = CL10B475KQ8NQNC: LCSC Part Name: 4.7uF ±10% 6.3V; Supplier Part: C107368; Manufacturer: SAMSUNG(三星); Supplier Footprint: 0603; JLCPCB Part Class: 扩展库; Datasheet: https://atta.szlcsc.com/upload/public/pdf/source/20160218/1457707763339.pdf; Supplier: LCSC; Tolerance: ±10%; Voltage Rated: 6.3V; Temperature Coefficient: X7R
C11 C12 = CC0201KRX7R5BB104: LCSC Part Name: 100nF ±10% 6.3V; Supplier Part: C1882920; Manufacturer: YAGEO(国巨); Supplier Footprint: 0201; JLCPCB Part Class: 扩展库; Datasheet: https://atta.szlcsc.com/upload/public/pdf/source/20210526/C1882920_D9D8C0826F711D89E4322037F9B616A1.pdf; Supplier: LCSC; Tolerance: ±10%; Voltage Rated: 6.3V; Temperature Coefficient: X7R
L1 = FNR3015S220MT: LCSC Part Name: 22uH ±20% 680mA; Supplier Part: C167761; Manufacturer: cjiang(长江微电); Supplier Footprint: SMD,3x3mm; JLCPCB Part Class: 扩展库; Datasheet: https://atta.szlcsc.com/upload/public/pdf/source/20190327/C167925_9EFF0AABC4CA629C2CC95961DBF7D39D.pdf; Supplier: LCSC; Tolerance: ±20%; Rated Current: 690mA; Saturation Current (Isat): 680mA; DC Resistance (DCR): 598mΩ
R1 = FRC0603J103 TS: LCSC Part Name: 10kΩ ±5% 100mW 厚膜电阻; Supplier Part: C2930027; Manufacturer: FOJAN(富捷); Supplier Footprint: 0603; JLCPCB Part Class: 扩展库; Datasheet: https://atta.szlcsc.com/upload/public/pdf/source/20211221/925EC7D7225764EE0046F22065062C87.pdf; Supplier: LCSC; Type: 厚膜电阻; Tolerance: ±5%; Power(Watts): 100mW; Voltage-Supply(Max): 75V; Temperature Coefficient: ±100ppm/℃; Operating Temperature: -55℃~+155℃
U1 = TPS5430DDAR: LCSC Part Name: 宽输入范围、3A输出电流的降压转换器; Supplier Part: C9864; Manufacturer: TI(德州仪器); Supplier Footprint: SOIC-8-EP; JLCPCB Part Class: 基础库; Datasheet: https://www.ti.com/cn/lit/gpn/tps5430; Supplier: LCSC; Function: 降压型; Output Type: 可调; Input Voltage: 5.5V~36V; Output Voltage: 1.221V~32.04V; Output Current: 3A; Switching Frequency: 500kHz; Operating Temperature: -40℃~+125℃@(TJ); Synchronous Rectification: 否; Number of Outputs: 1; Topology: 降压式; Switch tube (built-in/external): 内置
U2 = RVT1A220M0405 22UF 10V: LCSC Part Name: 22uF ±20% 10V; Supplier Part: C970661; Manufacturer: DMBJ(振宝佳); Supplier Footprint: SMD,D4xL5.4mm; JLCPCB Part Class: 扩展库; Datasheet: https://atta.szlcsc.com/upload/public/pdf/source/20201217/C970594_282EC4D70669AEE33806F6C24A5FAA0B.pdf; Supplier: LCSC; Tolerance: ±20%; Voltage Rating: 10V; Ripple Current: 21mA@120Hz; Diameter: 4mm; Height - Seated (Max): 5.4mm; Lifetime: 2800hrs@105℃; Operating Temperature: -55℃~+105℃
U3 = AMS1117-3.3: LCSC Part Name: 输入18V 输出3.3V 1A; Supplier Part: C2891839; Manufacturer: YONGYUTAI(永裕泰); Supplier Footprint: SOT-223-3; JLCPCB Part Class: 扩展库; Datasheet: https://atta.szlcsc.com/upload/public/pdf/source/20210901/A75ADDE6A17DEE0002F2A58A8D1F3634.pdf; Supplier: LCSC; Output Type: 固定; Maximum Input Voltage: 18V; Output Voltage: 3.3V; MAX Output Current: 1A; Power Supply Rejection Ratio (PSRR): 60dB@(120Hz); Dropout Voltage: 1.3V@(1A); standby current: 5mA; Noise: 0.005%Vout; Operating Temperature: -40℃~+125℃@(Tj); Output Polarity: 正极; Number of Outputs: 1
U4 = SATA_470182011: Supplier Part: C2936562; JLCPCB Part Class: 扩展库; Supplier: LCSC
U14 = SATA-A: Supplier Part: C9900004587; Supplier Footprint: sata-7p; JLCPCB Part Class: 扩展库; Supplier: LCSC

## Nets
GND: U1.6(GND) U1.9(PowerPAD) U3.1(ADJ(GND)) U4.11 U4.12 U4.13 U4.17 U4.19 U4.23 U4.24 U14.8 U14.9
DC12V: C1.1 U1.7(VIN)
SATA3.3V: C12.2 U4.8 U4.9 U4.10
SATA5V: C8.1 U4.14 U4.15 U4.16
SATA12V: C4.1 U4.20 U4.21 U4.22
Net-(C1-2): C1.2 C2.1
Net-(C2-2): C2.2 C3.1
Net-(C3-2): C3.2 C4.2
Net-(C5-1): C5.1 L1.1 U1.8(PH)
Net-(C5-2): C5.2 U1.1(BOOT)
Net-(C6-1): C6.1 L1.2 R1.1 U3.3(VIN)
Net-(C6-2): C6.2 U2.1
Net-(C7-1): C7.1 U2.2
Net-(C7-2): C7.2 C8.2
Net-(C9-1): C9.1 U3.2(VOUT) U3.4(VOUT)
Net-(C9-2): C9.2 C10.1
Net-(C10-2): C10.2 C11.1
Net-(C11-2): C11.2 C12.1
Net-(R1-2): R1.2 U1.4(VSENSE)
Net-(U4-1): U4.1 U14.1
Net-(U4-2): U4.2 U14.2
Net-(U4-3): U4.3 U14.3
Net-(U4-4): U4.4 U14.4
Net-(U4-5): U4.5 U14.5
Net-(U4-6): U4.6 U14.6
Net-(U4-7): U4.7 U14.7

Not connected (* = marked no-connect by the designer): U1 2(NC)* 3(NC)* 5(ENA)*; U4 18*

# Board 主要板
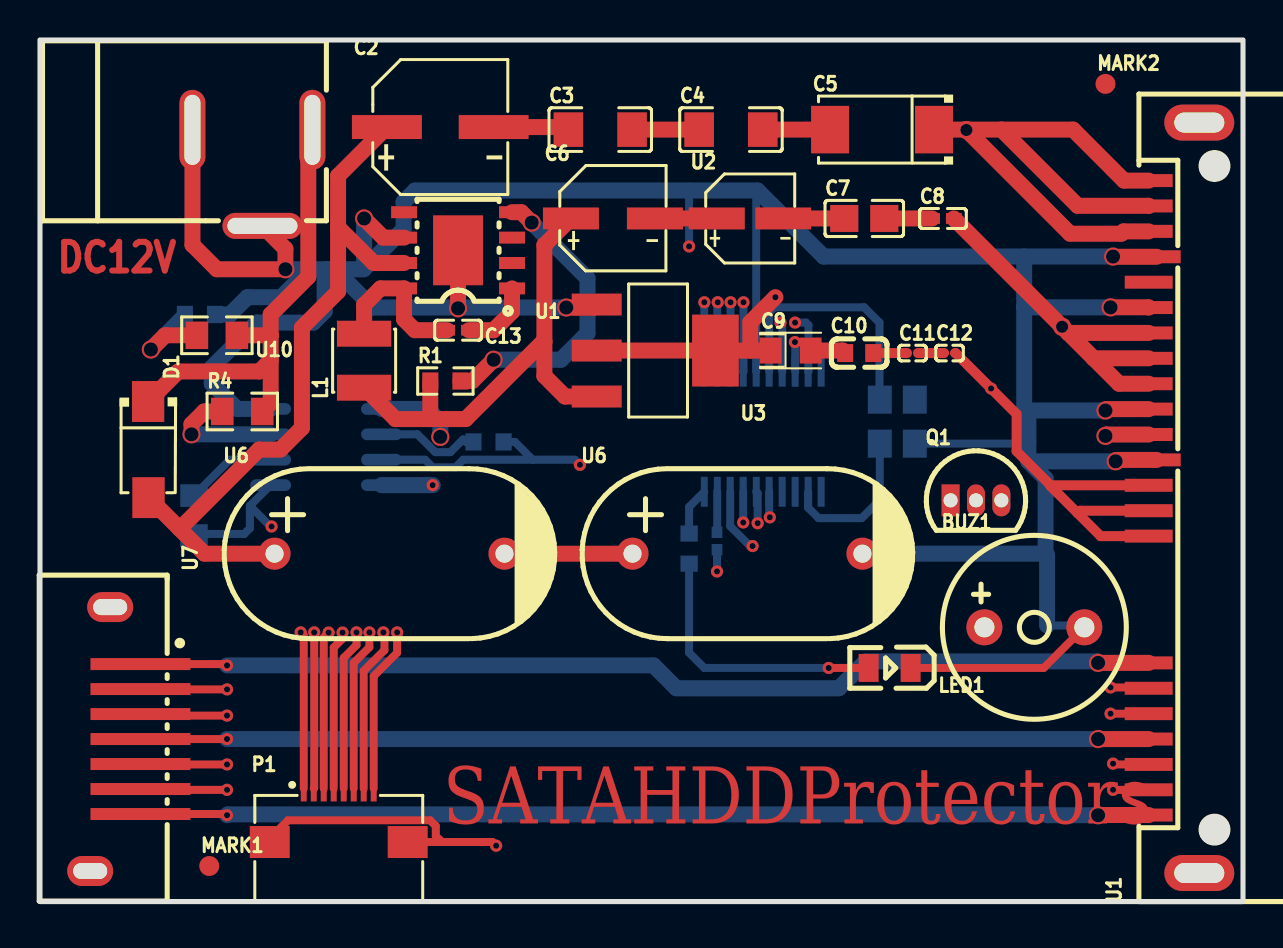
[diagram p2: board, top side]
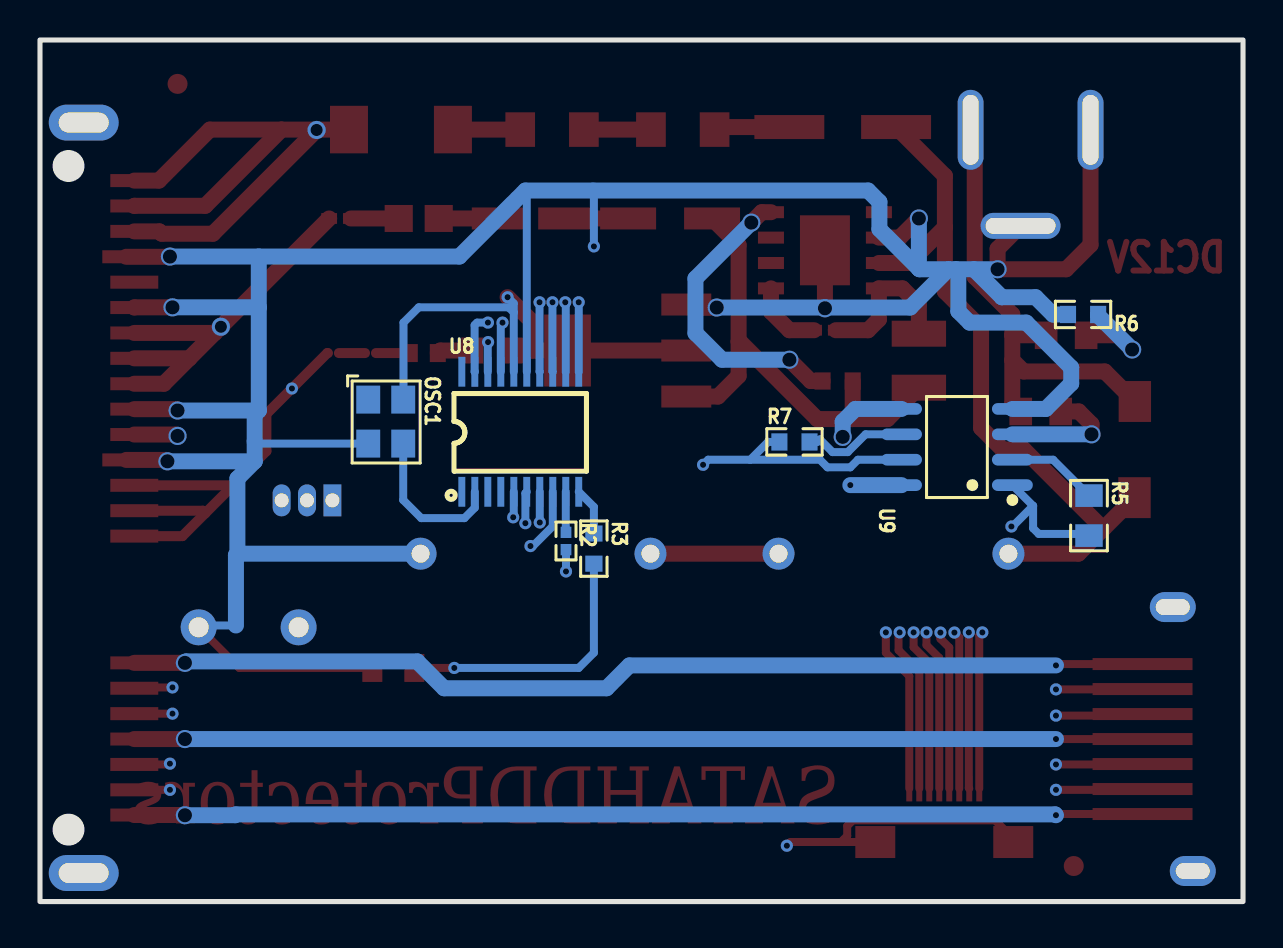
[diagram p3: board, bottom side, seen from below]

Outline 60.18 x 43.09 mm; copper layers: Top Layer, Inner1, Inner2, Bottom Layer. Coordinates in mm from the lower left corner of the outline.
Outline path: rectangle 0,43.09 60.18,0
Stack: Top Layer 0.035mm 外层铜厚1oz / Dielectric1 0.2104mm 7628 RC49% 8.6mil / Inner1 0.0152mm 内层铜厚 / Dielectric2 1.065mm 1.1mm H/HOZ Copper / Inner2 0.0152mm 内层铜厚 / Dielectric3 0.2104mm 7628 RC49% 8.6mil / Bottom Layer 0.035mm 外层铜厚1oz

## Design rules (mm)
template: JLCPCB Capability(Two Layers Board)
spacing copperThickness1oz (default): track to track 0.102, other pairs 0.152 to 0.3
spacing copperThickness2oz: track to track 0.203, other pairs 0.152 to 0.3
track width copperThickness1oz (default): min 0.127, default 0.254, max 2.54
track width copperThickness2oz: min 0.203, default 0.254, max 2.54
differential pair differentialPair (default): width min 0.127, default 0.254, max 2.54; gap min 0.152, default 0.152
via viaSize (default): diameter min 0.5, default 0.61, max 10; hole min 0.3, default 0.305, max 6.3

## Placement (name value [footprint] x y rotation side)
BUZ1  蜂鸣器  [BUZ-TH_BD9.0-P5.00-D0.6-FD]  49.74 13.72 0 top
C2  10uF  [CAP-SMD_BD6.3-L6.6-W6.6-LS7.6-FD-1]  20.03 38.74 0 top
C3  10uF  [C1206]  28.03 38.61 0 top
C4  47uF  [C1206]  34.57 38.61 0 top
C5  100nF  [CAP-SMD_L6.0-W3.2-R-RD]  42.12 38.61 0 top
C6  100uF  [CAP-SMD_BD5.0-L5.3-W5.3-LS6.0-FD]  28.66 34.16 0 top
C7  10uF  [C0805]  41.23 34.16 0 top
C8  100nF  [C0402]  45.17 34.16 0 top
C9  10uF  [CAP-SMD_L2.0-W1.3-FD]  37.55 27.56 0 top
C10  4.7uF  [C0603]  40.98 27.43 0 top
C11  100nF  [C0201]  43.65 27.43 0 top
C12  100nF  [C0201]  45.5 27.43 0 top
C13  100nF  [C0402]  20.91 28.58 180 top
D1  SS34  [SMA_L4.3-W2.6-LS5.0-RD]  5.42 22.61 270 top
DC1  -  [DC-2.0]  10.5 38.86 180 top
L1  22uH  [IND-SMD_L3.0-W3.0_FNR30XXS]  16.22 27.05 90 top
LED1  KT-0805W  [LED0805-R-RD]  42.5 11.68 180 top
MARK1  -  [Mark-Point-1mm]  8.47 1.78 0 top
MARK2  -  [Mark-Point-1mm]  53.3 40.89 0 top
OSC1  30MHz  [OSC-SMD_4P-L3.2-W2.5-BL]  42.89 24 270 bottom
P1  FFC_0.5_8  [CONN-SMD_8P-P0.50_FGXJ]  14.95 4.32 0 top
Q1  2N3904  [TO-92-3_L4.9-W3.7-P1.27-L]  46.82 20.07 0 top
R1  10kΩ  [R0603]  20.28 26.04 0 top
R2  220Ω  [R0402]  33.87 18.03 270 bottom
R3  1kΩ  [R0603]  32.47 17.65 270 bottom
R4  100mΩ  [R0805]  10.12 24.51 0 top
R5  19kΩ  [R0805]  7.71 19.3 270 bottom
R6  1k  [R0603]  8 29.36 0 bottom
R7  1k  [R0603]  22.44 22.99 180 bottom
U1  TPS5430DDAR  [CONN-SMD_22P-SATA_470182011]  56.73 20.19 90 top
U1#2  -  [ESOP-8_L4.9-W3.9-P1.27-LS6.0-TL-EP]  20.91 32.57 180 top
U2  22uF  [CAP-SMD_BD4.0-L4.3-W4.3-LS5.0-FD]  35.52 34.16 0 top
U3  AMS1117-3.3  [SOT-223-3_L6.5-W3.4-P2.30-LS7.0-BR]  30.82 27.56 180 top
U6  -  [CAP-TH_L16.0-W8.0-P11.50-D0.6]  35.39 17.4 0 top
U6#2  -  [CAP-TH_L16.0-W8.0-P11.50-D0.6]  17.49 17.4 0 top
U7  SATA-A  [CONN-SMD_SATA-A]  3.77 8.13 270 top
U8  STM32F030F4P6TR  [SOP-20_L6.5-W4.4-P0.65-LS6.4-BL]  36.15 23.5 180 bottom
U9  LM358BIDR  [SOIC-8_L4.9-W3.9-P1.27-LS6.0-BL]  14.31 22.73 90 bottom
U10  10K  [R0805]  8.85 28.32 180 top

## Footprints (pads in the part's own frame, mm; a bottom-side part is the same pattern mirrored in y, then rotated)
BUZ-TH_BD9.0-P5.00-D0.6-FD
  round 1.8 hole 1: 1(-2.5,0) 2(2.5,0)
C0201
  rect 0.368x0.324 smd: 1(-0.275,0) 2(0.275,0)
C0402
  rect 0.79x0.54 smd: 1(-0.545,0) 2(0.545,0)
C0603
  rect 0.8x0.9 smd: 1(-0.7,0) 2(0.7,0)
C0805
  rect 1.41x1.35 smd: 1(-1,0) 2(1,0)
C1206
  rect 1.485x1.728 smd: 1(-1.593,0) 2(1.593,0)
CAP-SMD_BD4.0-L4.3-W4.3-LS5.0-FD
  rect 2.8x1.1 smd: 1(-1.661,0) 2(1.661,0)
CAP-SMD_BD5.0-L5.3-W5.3-LS6.0-FD
  rect 2.8x1.1 smd: 1(-2.1,0) 2(2.1,0)
CAP-SMD_BD6.3-L6.6-W6.6-LS7.6-FD-1
  rect 3.5x1.2 smd: 1(-2.67,0) 2(2.67,0)
CAP-SMD_L2.0-W1.3-FD
  rect 1.1x1.3 smd: 1(-1,0) 2(1,0)
CAP-SMD_L6.0-W3.2-R-RD
  rect 1.9x2.376 smd: 1(2.6,0) 2(-2.6,0)
CAP-TH_L16.0-W8.0-P11.50-D0.6
  round 1.6 hole 0.9: 1(-5.75,0) 2(5.75,0)
CONN-SMD_8P-P0.50_FGXJ
  rect 0.3x1.3 smd: 1(-1.75,1.34) 2(-1.25,1.34) 3(-0.75,1.34) 4(-0.25,1.34) 5(0.25,1.34) 6(0.75,1.34) 7(1.25,1.34) 8(1.75,1.34)
  rect 2x1.6 smd: 9(-3.45,-1.34) 10(3.45,-1.34)
CONN-SMD_22P-SATA_470182011
  rect 0.65x2.4 smd: 1(-15.865,1.265) 2(-14.605,1.265) 3(-13.335,1.265) 4(-12.065,1.265) 5(-10.795,1.265) 6(-9.525,1.265) 7(-8.255,1.265) 8(-1.915,1.265) 9(-0.645,1.265) 10(0.625,1.265) 11(1.895,0.865) 12(3.165,1.265) 13(4.435,1.265) 14(5.705,1.265) 15(6.975,1.265) 16(8.245,1.265) 17(9.515,1.265) 18(10.785,1.265) 19(12.055,0.865) 20(13.325,1.265) 21(14.595,1.265) 22(15.865,1.265)
  oval 1.8x3.5 hole 1x2.5: 23(18.765,-1.265) 24(-18.765,-1.265)
CONN-SMD_SATA-A
  rect 0.6x5 smd: 1(-3.75,1.256) 2(-2.5,1.256) 3(-1.25,1.256) 4(0,1.256) 5(1.25,1.256) 6(2.5,1.256) 7(3.75,1.256)
  oval 1.5x2.3 hole 0.8x1.7: 8(-6.6,-0.257) 9(6.6,-1.256)
DC-2.0
  oval 4x1.3 hole 3.5x0.8: 2(-0.627,5.067)
  oval 1.3x4 hole 0.8x3.5: 3(2.873,0.267) 4(-3.127,0.267)
ESOP-8_L4.9-W3.9-P1.27-LS6.0-TL-EP
  rect 1.3x0.6 smd: 1(-2.7,1.905) 2(-2.7,0.635) 3(-2.7,-0.635) 4(-2.7,-1.905) 5(2.7,-1.905) 6(2.7,-0.635) 7(2.7,0.635) 8(2.7,1.905)
  rect 2.5x3.5 smd: 9(0,0)
IND-SMD_L3.0-W3.0_FNR30XXS
  rect 1.3x2.72 smd: 1(1.35,0) 2(-1.35,0)
LED0805-R-RD
  rect 1x1.399 smd: 1(1.05,0) 2(-1.05,0)
Mark-Point-1mm
  round 1 smd: 1(0,0)
OSC-SMD_4P-L3.2-W2.5-BL
  rect 1.4x1.2 smd: 1(-1.1,-0.875) 2(1.1,-0.875) 3(1.1,0.875) 4(-1.1,0.875)
R0402
  rect 0.566x0.54 smd: 1(-0.433,0) 2(0.433,0)
R0603
  rect 0.806x0.864 smd: 1(-0.753,0) 2(0.753,0)
R0805
  rect 1.133x1.377 smd: 1(-1,0) 2(1,0)
SMA_L4.3-W2.6-LS5.0-RD
  rect 2.046x1.62 smd: 1(-2.404,-0.009) 2(2.404,0.009)
SOIC-8_L4.9-W3.9-P1.27-LS6.0-BL
  oval 0.588x2.045 smd: 1(-1.905,-2.772) 2(-0.635,-2.772) 3(0.635,-2.772) 4(1.905,-2.772) 5(1.905,2.772) 6(0.635,2.772) 7(-0.635,2.772) 8(-1.905,2.772)
SOP-20_L6.5-W4.4-P0.65-LS6.4-BL
  rect 0.35x1.494 smd: 1(-2.925,-3.001) 2(-2.275,-3.001) 3(-1.625,-3.001) 4(-0.975,-3.001) 5(-0.325,-3.001) 6(0.324,-3.001) 7(0.975,-3.001) 8(1.625,-3.001) 9(2.275,-3.001) 10(2.925,-3.001) 11(2.925,3.001) 12(2.275,3.001) 13(1.625,3.001) 14(0.975,3.001) 15(0.325,3.001) 16(-0.325,3.001) 17(-0.975,3.001) 18(-1.625,2.996) 19(-2.275,2.996) 20(-2.925,3.001)
SOT-223-3_L6.5-W3.4-P2.30-LS7.0-BR
  rect 2.5x1.1 smd: 1(2.97,-2.3) 2(2.97,0) 3(2.97,2.3)
  rect 2.34x3.6 smd: 4(-2.97,0)
TO-92-3_L4.9-W3.7-P1.27-L
  rect 0.9x1.6 hole 0.7: 1(-1.27,0)
  oval 0.9x1.6 hole 0.7: 2(0,0) 3(1.27,0)

## Nets
As in the schematic.

Pads without a net: BUZ1 1 2; C2 1 2; C3 1 2; C4 1 2; C5 1 2; C6 1 2; C7 1 2; C8 1 2; C9 1 2; C10 1 2; C11 1 2; C12 1 2; C13 1 2; D1 1 2; DC1 2 3 4; L1 1 2; LED1 1 2; MARK1 1; MARK2 1; OSC1 1 2 3 4; P1 1 2 3 4 5 6 7 8 9 10; Q1 1 2 3; R1 1 2; R2 1 2; R3 1 2; R4 1 2; R5 1 2; R6 1 2; R7 1 2; U1 1 2 3 4 5 6 7 8 9 10 11 12 13 14 15 16 17 18 19 20 21 22 23 24; U1#2 1 2 3 4 5 6 7 8 9; U2 1 2; U3 1 2 3 4; U6 1 2; U6#2 1 2; U7 1 2 3 4 5 6 7 8 9; U8 1 2 3 4 5 6 7 8 9 10 11 12 13 14 15 16 17 18 19 20; U9 1 2 3 4 5 6 7 8; U10 1 2

## Via types
v1: diameter 0.61, hole 0.305, Top Layer to Bottom Layer, 39 vias
v2: diameter 0.91, hole 0.605, Top Layer to Bottom Layer, 2 vias
v3: diameter 0.91, hole 0.705, Top Layer to Bottom Layer, 17 vias

## Routing (per net, layer and track width the routed paths; a pad name or vN(x,y) marks a point on that pad's centre or on a via; arc(x,y) is an arc through that point)
(no net): length 1334.2
  Top Layer w0.4: v1(39.46,11.68) LED1.1 ; P1.2 13.72,5.68 v1(13.72,13.46) ; v1(15.83,13.46) 15.83,12.83 15.2,12.19 P1.5 ; v1(9.36,4.32) 9.3,4.38 U7.7 ; v1(9.36,8.13) U7.4 ; P1.8 16.7,11.28 17.87,12.45 v1(17.87,13.46) ; P1.6 15.7,11.94 16.48,12.72 v1(16.48,13.46) ; v1(53.55,10.71) 55.42,10.71 U1.6 ; LED1.2 50.21,11.68 BUZ1.2 ; v1(15.14,13.45) 15.14,13.15 14.7,12.7 P1.4 ; v1(14.44,13.45) 14.2,13.21 P1.3 ; U1.5 v1(53.55,9.4) ; P1.1 13.2,13.31 v1(13.04,13.46) ; U1.3 53.72,6.86 v1(53.68,6.9) ; v1(17.18,13.46) 17.23,13.41 17.23,12.57 16.2,11.54 P1.7 ; U7.5 5.05,6.86 v1(9.36,6.86) ; 19.91,2.98 20.01,3.08 19.8,3.28 19.8,3.78 19.52,4.06 12.41,4.06 11.5,3.15 P1.9 ; 19.91,2.98 22.64,2.98 v1(22.82,2.79) ; 19.91,2.98 P1.10 ; U7.1 9.29,11.88 v1(9.36,11.81) ; U7.2 5.04,10.61 v1(9.36,10.61) ; U1.2 v1(53.68,5.59) ; U7.3 5.1,9.3 v1(9.36,9.3) ; U7.6 5.07,5.59 v1(9.36,5.59)
  Top Layer w0.5: 50.56,20.82 50.54,20.8 51.91,19.42 ; 50.56,20.82 U1.10 ; 50.56,20.82 48.85,22.52 48.85,24.38 v1(47.58,25.66) 45.81,27.43 C12.2 ; U1.9 52.04,19.55 51.91,19.42 ; U1.8 53.06,18.28 51.91,19.42 ; C11.2 C12.1 ; C10.2 C11.1
  Top Layer w0.8: 51.44,28.44 C8.2 ; 51.44,28.44 52.71,27.17 ; 51.44,28.44 U1.16 ; D1.1 6.91,26.51 10.98,26.51 11.54,27.08 ; v3(22.69,27.1) 21.63,26.04 R1.2 ; C10.1 40.15,27.56 C9.2 ; U1.14 53.98,25.9 52.71,27.17 ; v3(5.55,27.61) 6.26,28.32 U10.2 ; U1.17 55.45,29.72 v3(53.55,29.72) ; v3(53.68,32.26) 53.69,32.25 55.86,32.25 ; U1#2.6 17.17,33.21 v3(16.22,34.16) ; U10.1 11.53,28.32 11.54,28.33 ; 11.54,27.08 11.54,24.93 R4.2 ; 11.54,27.08 11.54,28.33 ; C6.2 U2.1 ; 14.91,33.72 16.7,31.94 U1#2.7 ; 14.91,33.72 14.91,36.29 C2.1 ; 14.91,33.72 14.91,30.51 13.1,28.7 13.1,23.69 12.02,22.61 10.96,22.61 6.99,18.64 ; 25.23,28.01 25.23,26.29 26.26,25.26 U3.3 ; 25.23,28.01 25.17,28.01 21.3,24.13 19.55,24.13 ; 25.23,28.01 25.23,32.83 C6.1 ; 48.1,38.61 51.91,34.8 55.45,34.8 U1.21 ; 48.1,38.61 46.32,38.61 ; 48.1,38.61 51.68,38.61 54.23,36.06 U1.22 ; v3(20.91,29.67) U1#2.9 ; C3.1 26.31,38.74 C2.2 ; U1#2.1 23.61,29.5 22.69,28.58 21.46,28.58 ; C7.2 C8.1 ; 6.99,18.64 8.23,17.4 U6#2.1 ; 6.99,18.64 D1.2 ; U1.12 53.37,23.36 v3(53.3,23.29) ; v3(53.81,22.02) 53.88,22.09 55.86,22.09 ; C4.2 C5.2 ; R4.1 8.21,24.51 7.58,23.88 v3(7.58,23.37) ; L1.1 16.22,29.85 17.04,30.67 U1#2.8 18.21,29.12 18.76,28.58 C13.2 ; 52.71,27.17 U1.15 ; 46.32,38.61 51.53,33.4 54.09,33.4 54.21,33.52 U1.20 ; 46.32,38.61 C5.1 ; v3(26.33,29.71) 27.7,29.71 U3.1 ; v1(36.79,30.23) 35.53,28.97 35.53,27.56 ; U3.2 U3.4 35.53,27.56 ; U1#2.4 24.08,34.48 v3(24.6,33.96) ; U1.1 52.94,4.33 v3(52.93,4.32) ; 35.53,27.56 C9.1 ; U6#2.2 U6.1 ; 11.54,28.33 11.54,29.36 13.42,31.24 13.42,38.39 DC1.4 ; R1.1 19.53,24.15 19.55,24.13 ; U1.13 53.37,24.63 v3(53.3,24.56) ; L1.2 17.79,24.13 19.55,24.13 ; v3(52.93,11.94) U1.7 ; C3.2 C4.1 ; U1.4 v3(52.93,8.13) ; DC1.2 12.28,32.64 v3(12.28,31.62) 8.85,31.62 7.63,32.84 DC1.3 ; U2.2 C7.1
  Inner1 w0.4: v1(36.79,30.23) 36.51,29.95 36.51,26.93 ; v1(53.68,5.59) v1(9.36,5.59) ; Q1.1 45.55,15.41 BUZ1.1 ; v1(19.64,20.83) 30.41,20.83 36.51,26.93 ; v1(53.68,6.9) 9.4,6.9 v1(9.36,6.86) ; v1(9.36,9.3) 53.46,9.3 v1(53.55,9.4) ; v1(53.55,10.71) 9.45,10.71 v1(9.36,10.61) ; 36.51,22.66 36.58,22.73 46.06,22.73 48.09,20.7 Q1.3 ; 36.51,22.66 v1(36.51,19.22) ; 36.51,22.66 36.51,26.93 ; v1(35.18,18.96) 34.98,18.76 v1(11.59,18.76) ; Q1.2 46.82,20.96 46.06,21.72 43.52,21.72 38.31,16.51 v1(33.87,16.51)
  Inner1 w0.8: v3(20.03,23.24) 20.03,23.88 16.29,27.61 v3(5.55,27.61)
  Inner2 w0.4: v1(35.65,17.78) 31.84,17.78 30.19,16.13 19.39,16.13 17.18,13.92 v1(17.18,13.46) ; v1(27.01,21.84) 31.63,21.84 v1(37.77,27.98) ; v1(13.72,13.46) 13.72,14.96 18.76,20 19.83,20 20.53,20.7 20.53,21.69 28.03,29.18 33.59,29.18 33.87,29.46 33.87,29.94 v1(33.9,29.97) ; v1(13.04,13.46) 13.04,15.24 27.77,29.97 v1(33.23,29.97) ; v1(15.14,13.45) 15.14,14.42 19.26,18.54 20.47,18.54 21.87,19.94 21.87,21.02 28.79,27.94 34.3,27.94 35.19,28.83 v1(35.19,29.97) ; v1(17.87,13.46) 19.77,15.37 30.31,15.37 32.09,17.15 35.9,17.15 36.28,17.53 36.28,18.54 v1(35.9,18.92) ; v1(22.82,2.79) 38.57,18.54 38.57,30.48 36.15,32.89 32.6,32.89 v1(32.47,32.77) ; v1(37.77,28.96) 36.63,27.81 35.52,27.81 34.38,26.67 29.17,26.67 23.07,20.57 23.07,19.43 21.04,17.4 19.9,17.4 16.48,13.98 v1(16.48,13.46) ; v1(15.83,13.46) 15.83,14.22 19.64,18.03 20.79,18.03 22.44,19.69 22.44,20.83 28.92,27.31 34.38,27.31 35.39,28.32 36.41,28.32 v1(37.04,28.96) ; v1(14.44,13.45) 14.44,14.73 19.01,19.3 20.28,19.3 21.17,20.19 21.17,21.21 28.53,28.58 34,28.58 34.54,29.12 v1(34.54,29.97)
  Bottom Layer w0.4: 24.65,22.1 26.76,22.1 v1(27.01,21.84) ; 24.65,22.1 23.76,22.99 R7.1 ; 24.65,22.1 21.17,22.1 20.79,21.72 19.64,21.72 19.26,22.1 U9.7 ; 35.9,35.56 35.83,35.49 U8.15 ; v1(33.9,29.97) 33.88,29.95 U8.12 ; 50.38,13.81 52.15,13.81 BUZ1.2 ; v1(36.51,19.22) 36.48,19.25 U8.5 ; U8.17 37.13,28.87 v1(37.04,28.96) ; U8.2 38.43,19.7 38.95,19.18 41.11,19.18 42.01,20.08 OSC1.3 ; OSC1.4 42,25.12 42,28.96 41.23,29.72 36.73,29.72 36.48,29.46 ; U9.2 9.5,22.1 R5.1 ; U8.6 35.9,20.42 v1(35.9,18.92) ; v1(32.47,32.77) 32.47,35.52 32.52,35.56 ; OSC1.2 49.33,22.9 49.44,23.02 ; 38.43,26.49 38.44,26.5 38.44,28.83 38.31,28.96 v1(37.77,28.96) ; 36.48,29.46 36.48,29.92 v1(36.79,30.23) ; 36.48,29.46 U8.16 ; U9.6 18.88,23.37 19.77,22.48 20.53,22.48 21.17,23.11 21.29,22.99 21.69,22.99 ; 37.78,26.49 37.78,27.97 v1(37.77,27.98) ; U8.8 34.53,18.77 35.52,17.78 v1(35.65,17.78) ; U8.7 v1(35.18,18.96) ; U8.11 33.23,29.97 v1(33.23,29.97) ; 10.5,19.79 11.53,18.76 v1(11.59,18.76) ; 10.5,19.79 10.5,18.67 10.22,18.39 7.79,18.39 R5.2 ; 10.5,19.79 U9.1 ; R2.2 v1(33.87,16.51) ; U8.14 35.19,26.51 v1(35.19,29.97) ; R3.1 32.47,19.74 U8.10 ; v1(34.54,29.97) 34.54,26.51 U8.13 ; R3.2 32.47,12.45 33.23,11.68 v1(39.46,11.68) ; R2.1 33.88,18.48 U8.9
  Bottom Layer w0.8: U6.2 50.3,17.4 ; 50.3,17.4 50.3,21.16 49.44,22.02 ; 50.3,17.4 50.38,17.33 50.38,13.81 ; v3(16.22,34.16) 16.22,31.65 ; 16.22,31.65 16.18,31.62 14.74,31.62 ; 16.22,31.65 18.19,33.63 18.19,34.99 18.76,35.56 35.9,35.56 39.2,32.26 49.24,32.26 ; v3(22.69,27.1) 26.06,27.1 27.39,28.43 27.39,31.16 v3(24.6,33.96) ; 13.46,31.62 v3(12.28,31.62) ; 13.46,31.62 12.07,30.23 10.37,30.23 9.51,29.36 R6.2 ; 13.46,31.62 14.35,31.62 ; v3(7.58,23.37) U9.3 ; 49.24,24.56 49.44,24.35 49.44,22.02 ; 49.24,24.56 49.24,29.72 ; 49.24,24.56 v3(53.3,24.56) ; 49.24,29.72 49.24,32.26 ; 49.24,29.72 v3(53.55,29.72) ; 49.24,32.26 v3(53.68,32.26) ; v3(52.93,4.32) 50.42,4.32 50.38,4.36 9.4,4.36 v1(9.36,4.32) ; v3(52.93,11.94) 52.86,12.01 41.31,12.01 39.96,10.67 31.84,10.67 30.69,11.81 v1(9.36,11.81) ; v3(26.33,29.71) 20.91,29.71 ; 20.91,29.71 v3(20.91,29.67) ; 20.91,29.71 16.65,29.71 14.74,31.62 ; v3(20.03,23.24) 20.03,24 19.39,24.64 U9.5 ; v1(9.36,8.13) v3(52.93,8.13) ; 49.44,22.02 v3(53.81,22.02) ; 14.74,31.62 14.35,31.62 ; 14.35,31.62 14.24,31.51 14.24,29.52 13.68,28.96 10.84,28.96 8.6,26.71 8.6,25.91 9.87,24.64 U9.4 ; v3(5.55,27.61) 7.25,29.31 R6.1 ; U9.8 v1(19.64,20.83)
  vias: v2(46.34,38.59) v2(51.13,28.75)

## Text on the board
Top Layer: DC12V | SATAHDDProtectors

# Board 子板
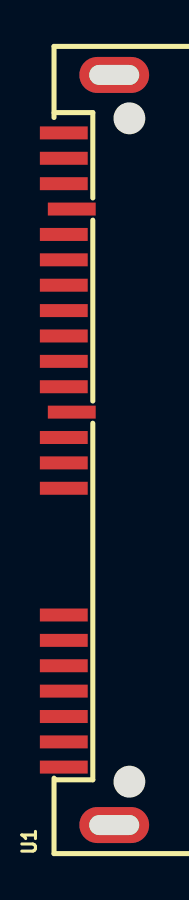
[diagram p4: board, top side]
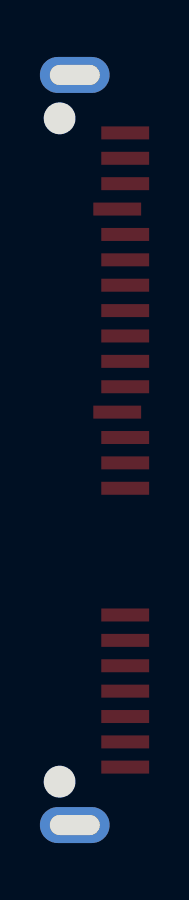
[diagram p5: board, bottom side, seen from below]

Outline 1.59 x 34.78 mm; copper layers: Top Layer, Bottom Layer. Coordinates in mm from the lower left corner of the outline.
Stack: Top Layer 0.035mm / Dielectric1 1.51mm FR4 er 4.5 / Bottom Layer 0.035mm

## Design rules (mm)
template: JLCPCB Capability(Two Layers Board)
spacing copperThickness1oz (default): track to track 0.102, other pairs 0.152 to 0.3
spacing copperThickness2oz: track to track 0.203, other pairs 0.152 to 0.3
track width copperThickness1oz (default): min 0.127, default 0.254, max 2.54
track width copperThickness2oz: min 0.203, default 0.254, max 2.54
differential pair differentialPair (default): width min 0.127, default 0.254, max 2.54; gap min 0.152, default 0.152
via viaSize (default): diameter min 0.5, default 0.61, max 10; hole min 0.3, default 0.305, max 6.3

## Placement (name value [footprint] x y rotation side)
U1  SATA_470182011  [CONN-SMD_22P-SATA_470182011]  -1.23 17.39 90 top

## Footprints (pads in the part's own frame, mm; a bottom-side part is the same pattern mirrored in y, then rotated)
CONN-SMD_22P-SATA_470182011
  rect 0.65x2.4 smd: 1(-15.865,1.265) 2(-14.605,1.265) 3(-13.335,1.265) 4(-12.065,1.265) 5(-10.795,1.265) 6(-9.525,1.265) 7(-8.255,1.265) 8(-1.915,1.265) 9(-0.645,1.265) 10(0.625,1.265) 11(1.895,0.865) 12(3.165,1.265) 13(4.435,1.265) 14(5.705,1.265) 15(6.975,1.265) 16(8.245,1.265) 17(9.515,1.265) 18(10.785,1.265) 19(12.055,0.865) 20(13.325,1.265) 21(14.595,1.265) 22(15.865,1.265)
  oval 1.8x3.5 hole 1x2.5: 23(18.765,-1.265) 24(-18.765,-1.265)

## Nets

Pads without a net: U1 1 2 3 4 5 6 7 8 9 10 11 12 13 14 15 16 17 18 19 20 21 22 23 24

# Board 无单片机版
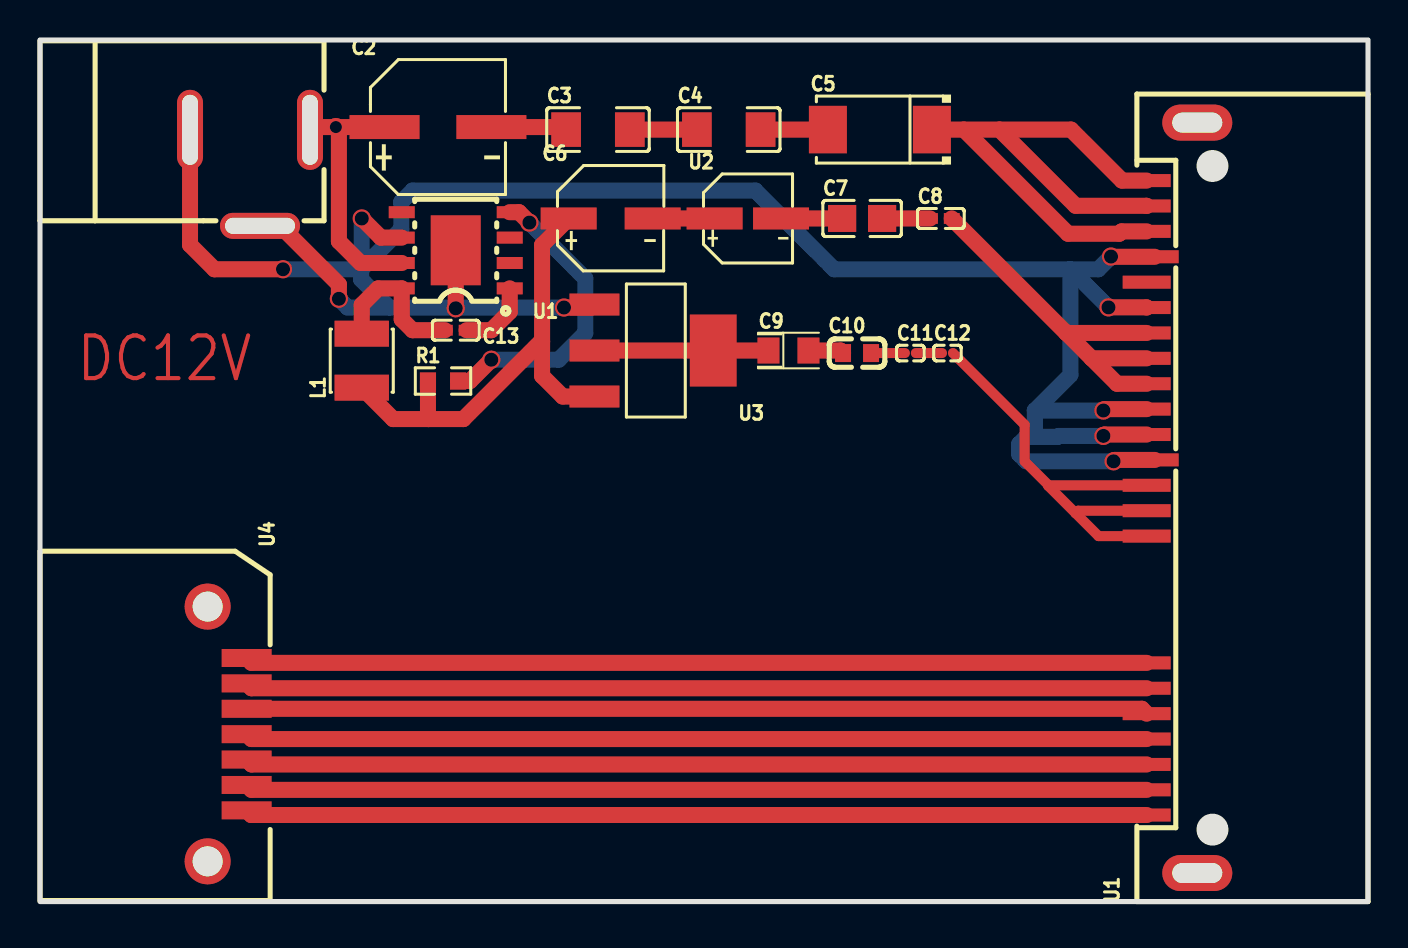
[diagram p6: board, top side]
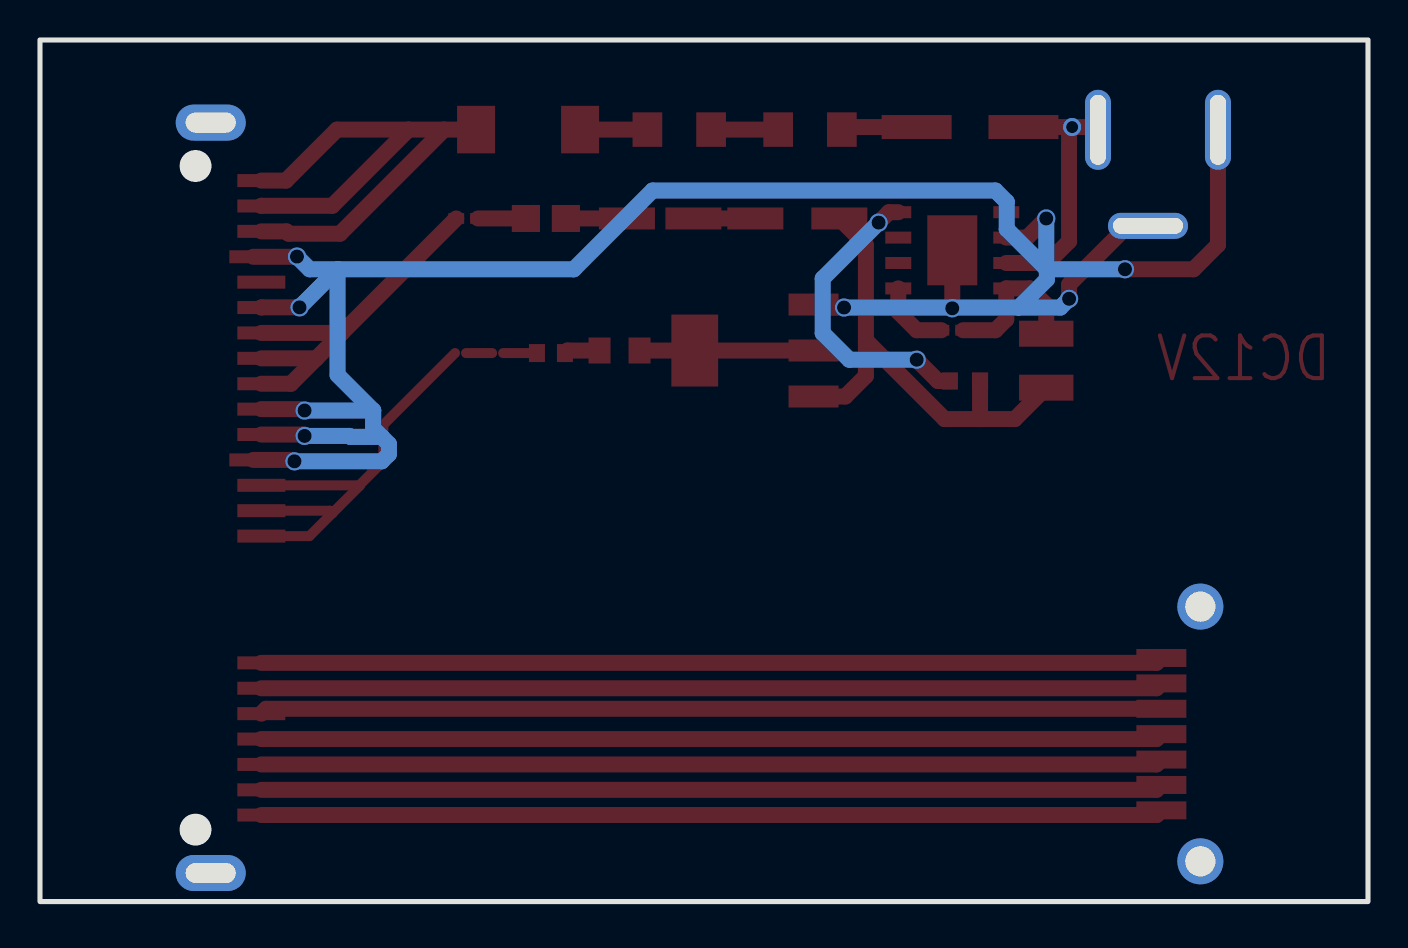
[diagram p7: board, bottom side, seen from below]

Outline 66.4 x 43.09 mm; copper layers: Top Layer, Bottom Layer. Coordinates in mm from the lower left corner of the outline.
Outline path: rectangle 0,43.09 66.4,0
Stack: Top Layer 0.035mm / Dielectric1 1.51mm FR4 er 4.5 / Bottom Layer 0.035mm

## Design rules (mm)
template: JLCPCB Capability(Two Layers Board)
spacing copperThickness1oz (default): track to track 0.102, other pairs 0.152 to 0.3
spacing copperThickness2oz: track to track 0.203, other pairs 0.152 to 0.3
track width copperThickness1oz (default): min 0.127, default 0.254, max 2.54
track width copperThickness2oz: min 0.203, default 0.254, max 2.54
differential pair differentialPair (default): width min 0.127, default 0.254, max 2.54; gap min 0.152, default 0.152
via viaSize (default): diameter min 0.5, default 0.61, max 10; hole min 0.3, default 0.305, max 6.3

## Placement (name value [footprint] x y rotation side)
C2  10uF  [CAP-SMD_BD6.3-L6.6-W6.6-LS7.6-FD-1]  19.9 38.74 0 top
C3  10uF  [C1206]  27.9 38.61 0 top
C4  47uF  [C1206]  34.44 38.61 0 top
C5  100nF  [CAP-SMD_L6.0-W3.2-R-RD]  42 38.61 0 top
C6  100uF  [CAP-SMD_BD5.0-L5.3-W5.3-LS6.0-FD]  28.53 34.16 0 top
C7  10uF  [C0805]  41.11 34.16 0 top
C8  100nF  [C0402]  45.04 34.16 0 top
C9  10uF  [CAP-SMD_L2.0-W1.3-FD]  37.42 27.56 0 top
C10  4.7uF  [C0603]  40.85 27.43 0 top
C11  100nF  [C0201]  43.52 27.43 0 top
C12  100nF  [C0201]  45.38 27.43 0 top
C13  100nF  [C0402]  20.79 28.58 180 top
DC1  -  [DC-2.0]  10.37 38.86 180 top
L1  22uH  [IND-SMD_L3.0-W3.0_FNR30XXS]  16.09 27.05 90 top
R1  10kΩ  [R0603]  20.15 26.04 0 top
U1  TPS5430DDAR  [ESOP-8_L4.9-W3.9-P1.27-LS6.0-TL-EP]  20.79 32.57 180 top
U1#2  -  [CONN-SMD_22P-SATA_470182011]  56.6 20.19 90 top
U2  22uF  [CAP-SMD_BD4.0-L4.3-W4.3-LS5.0-FD]  35.39 34.16 0 top
U3  AMS1117-3.3  [SOT-223-3_L6.5-W3.4-P2.30-LS7.0-BR]  30.69 27.56 180 top
U4  SATA_470182011  [CONN-SMD_SATA-401-M07S1BY-A]  9.36 8.38 270 top

## Footprints (pads in the part's own frame, mm; a bottom-side part is the same pattern mirrored in y, then rotated)
C0201
  rect 0.368x0.324 smd: 1(-0.275,0) 2(0.275,0)
C0402
  rect 0.79x0.54 smd: 1(-0.545,0) 2(0.545,0)
C0603
  rect 0.8x0.9 smd: 1(-0.7,0) 2(0.7,0)
C0805
  rect 1.41x1.35 smd: 1(-1,0) 2(1,0)
C1206
  rect 1.485x1.728 smd: 1(-1.593,0) 2(1.593,0)
CAP-SMD_BD4.0-L4.3-W4.3-LS5.0-FD
  rect 2.8x1.1 smd: 1(-1.661,0) 2(1.661,0)
CAP-SMD_BD5.0-L5.3-W5.3-LS6.0-FD
  rect 2.8x1.1 smd: 1(-2.1,0) 2(2.1,0)
CAP-SMD_BD6.3-L6.6-W6.6-LS7.6-FD-1
  rect 3.5x1.2 smd: 1(-2.67,0) 2(2.67,0)
CAP-SMD_L2.0-W1.3-FD
  rect 1.1x1.3 smd: 1(-1,0) 2(1,0)
CAP-SMD_L6.0-W3.2-R-RD
  rect 1.9x2.376 smd: 1(2.6,0) 2(-2.6,0)
CONN-SMD_22P-SATA_470182011
  rect 0.65x2.4 smd: 1(-15.865,1.265) 2(-14.605,1.265) 3(-13.335,1.265) 4(-12.065,1.265) 5(-10.795,1.265) 6(-9.525,1.265) 7(-8.255,1.265) 8(-1.915,1.265) 9(-0.645,1.265) 10(0.625,1.265) 11(1.895,0.865) 12(3.165,1.265) 13(4.435,1.265) 14(5.705,1.265) 15(6.975,1.265) 16(8.245,1.265) 17(9.515,1.265) 18(10.785,1.265) 19(12.055,0.865) 20(13.325,1.265) 21(14.595,1.265) 22(15.865,1.265)
  oval 1.8x3.5 hole 1x2.5: 23(18.765,-1.265) 24(-18.765,-1.265)
CONN-SMD_SATA-401-M07S1BY-A
  rect 0.9x2.5 smd: 1(-3.8,0.975) 2(-2.53,0.975) 3(-1.26,0.975) 4(0.01,0.975) 5(1.28,0.975) 6(2.55,0.975) 7(3.82,0.975)
  round 2.3 hole 1.5: 8(6.37,-0.975) 9(-6.37,-0.975)
DC-2.0
  oval 4x1.3 hole 3.5x0.8: 2(-0.627,5.067)
  oval 1.3x4 hole 0.8x3.5: 3(2.873,0.267) 4(-3.127,0.267)
ESOP-8_L4.9-W3.9-P1.27-LS6.0-TL-EP
  rect 1.3x0.6 smd: 1(-2.7,1.905) 2(-2.7,0.635) 3(-2.7,-0.635) 4(-2.7,-1.905) 5(2.7,-1.905) 6(2.7,-0.635) 7(2.7,0.635) 8(2.7,1.905)
  rect 2.5x3.5 smd: 9(0,0)
IND-SMD_L3.0-W3.0_FNR30XXS
  rect 1.3x2.72 smd: 1(1.35,0) 2(-1.35,0)
R0603
  rect 0.806x0.864 smd: 1(-0.753,0) 2(0.753,0)
SOT-223-3_L6.5-W3.4-P2.30-LS7.0-BR
  rect 2.5x1.1 smd: 1(2.97,-2.3) 2(2.97,0) 3(2.97,2.3)
  rect 2.34x3.6 smd: 4(-2.97,0)

## Nets
As in the schematic.

Pads without a net: C2 1 2; C3 1 2; C4 1 2; C5 1 2; C6 1 2; C7 1 2; C8 1 2; C9 1 2; C10 1 2; C11 1 2; C12 1 2; C13 1 2; DC1 2 3 4; L1 1 2; R1 1 2; U1 1 2 3 4 5 6 7 8 9; U1#2 1 2 3 4 5 6 7 8 9 10 11 12 13 14 15 16 17 18 19 20 21 22 23 24; U2 1 2; U3 1 2 3 4; U4 1 2 3 4 5 6 7 8 9

## Via types
v1: diameter 0.91, hole 0.705, Top Layer to Bottom Layer, 12 vias
v2: diameter 0.91, hole 0.605, Top Layer to Bottom Layer, 1 via

## Routing (per net, layer and track width the routed paths; a pad name or vN(x,y) marks a point on that pad's centre or on a via; arc(x,y) is an arc through that point)
(no net): length 609.4
  Top Layer w0.5: 50.43,20.82 50.41,20.8 51.78,19.42 ; 50.43,20.82 49.24,22.02 49.24,23.85 C12.2 ; 50.43,20.82 U1#2.10 ; U1#2.8 52.93,18.28 51.78,19.42 ; 51.78,19.42 51.91,19.55 U1#2.9 ; C10.2 C11.1 ; C11.2 C12.1
  Top Layer w0.8: U4.2 10.58,10.67 U1#2.6 ; U1.1 23.49,29.5 22.57,28.58 21.33,28.58 ; C5.1 46.2,38.61 ; 46.2,38.61 47.97,38.61 ; 46.2,38.61 51.4,33.4 53.97,33.4 54.08,33.52 U1#2.20 ; v1(53.17,24.56) 53.24,24.63 U1#2.13 ; U3.3 26.14,25.26 25.11,26.29 25.11,28.01 ; U1#2.17 55.33,29.72 v1(53.43,29.72) ; 19.42,24.13 19.4,24.15 R1.1 ; 19.42,24.13 17.66,24.13 L1.2 ; 19.42,24.13 21.17,24.13 25.05,28.01 25.11,28.01 ; U1#2.14 53.85,25.9 52.58,27.17 ; v1(16.09,34.16) 17.04,33.21 U1.6 ; C13.2 18.63,28.58 18.09,29.12 U1.8 16.91,30.67 16.09,29.85 L1.1 ; U1.4 23.95,34.48 v1(24.47,33.96) ; U4.6 10.58,5.59 U1#2.2 ; U4.3 55.09,9.64 U1#2.5 ; 47.97,38.61 51.78,34.8 55.33,34.8 U1#2.21 ; 47.97,38.61 51.55,38.61 54.1,36.06 U1#2.22 ; DC1.2 12.01,33.79 14.95,30.86 v1(14.95,30.15) ; v2(14.79,38.74) 14.95,38.58 14.95,33.02 16.03,31.94 U1.7 ; v2(14.79,38.74) C2.1 ; v2(14.79,38.74) 13.64,38.74 DC1.4 ; v1(53.55,32.26) 53.56,32.25 55.74,32.25 ; 25.11,28.01 25.11,32.83 C6.1 ; v1(22.57,27.1) 21.5,26.04 R1.2 ; U1#2.3 10.58,6.86 U4.5 ; U1#2.12 53.24,23.36 v1(53.17,23.29) ; v1(20.79,29.67) U1.9 ; U1#2.4 10.58,8.13 U4.4 ; v1(53.68,22.02) 53.75,22.09 55.74,22.09 ; U1#2.15 52.58,27.17 ; 52.58,27.17 51.31,28.44 ; C4.2 C5.2 ; U1#2.7 10.58,11.94 U4.1 ; U4.7 10.57,4.33 U1#2.1 ; C6.2 U2.1 ; C9.1 U3.4 U3.2 ; C7.2 C8.1 ; v1(26.2,29.71) 27.57,29.71 U3.1 ; v1(12.15,31.62) 8.72,31.62 7.5,32.84 DC1.3 ; C9.2 40.03,27.56 C10.1 ; 51.31,28.44 U1#2.16 ; 51.31,28.44 C8.2 ; C3.1 26.18,38.74 C2.2 ; U2.2 C7.1 ; C3.2 C4.1
  Bottom Layer w0.8: 16.06,31.62 v1(12.15,31.62) ; 16.06,31.62 16.06,31.11 17.46,29.71 ; 16.06,31.62 16.09,31.65 ; v1(22.57,27.1) 25.93,27.1 27.26,28.43 27.26,31.16 v1(24.47,33.96) ; v1(14.95,30.15) 15.38,29.71 17.46,29.71 ; v1(53.55,32.26) 52.92,31.62 51.52,31.62 ; v1(26.2,29.71) 17.46,29.71 ; 49.31,23.24 50.89,23.24 50.93,23.29 v1(53.17,23.29) ; 49.31,23.24 49.74,23.67 49.74,24.56 ; 49.31,23.24 48.96,22.88 48.96,22.38 49.31,22.02 v1(53.68,22.02) ; v1(16.09,34.16) 16.09,31.65 ; 16.09,31.65 18.06,33.63 18.06,34.99 18.63,35.56 35.77,35.56 39.71,31.62 51.52,31.62 ; 51.52,31.62 51.52,26.34 49.74,24.56 ; 51.52,31.62 v1(53.43,29.72) ; 49.74,24.56 v1(53.17,24.56)

## Copper pours and planes (outline as drawn; the poured copper is in the pictures)
(no net) on Top Layer: 19.39,34.54 22.18,34.54 22.18,30.61 19.39,30.61

## Text on the board
Top Layer: DC12V
